# Altium project CW330_NewKintexFPGA.PrjPcb (part 3 of 5)

## Sheet CW340_SAM3X_MISC.SchDoc: MCU Misc Connections
size Letter; Organization: NewAE Technology Inc.; Address1: 1083 Queen St., Suite 196; Address2: Halifax; Address3: NS; Address4: Canada B3H 0B2; SheetApproved: NO
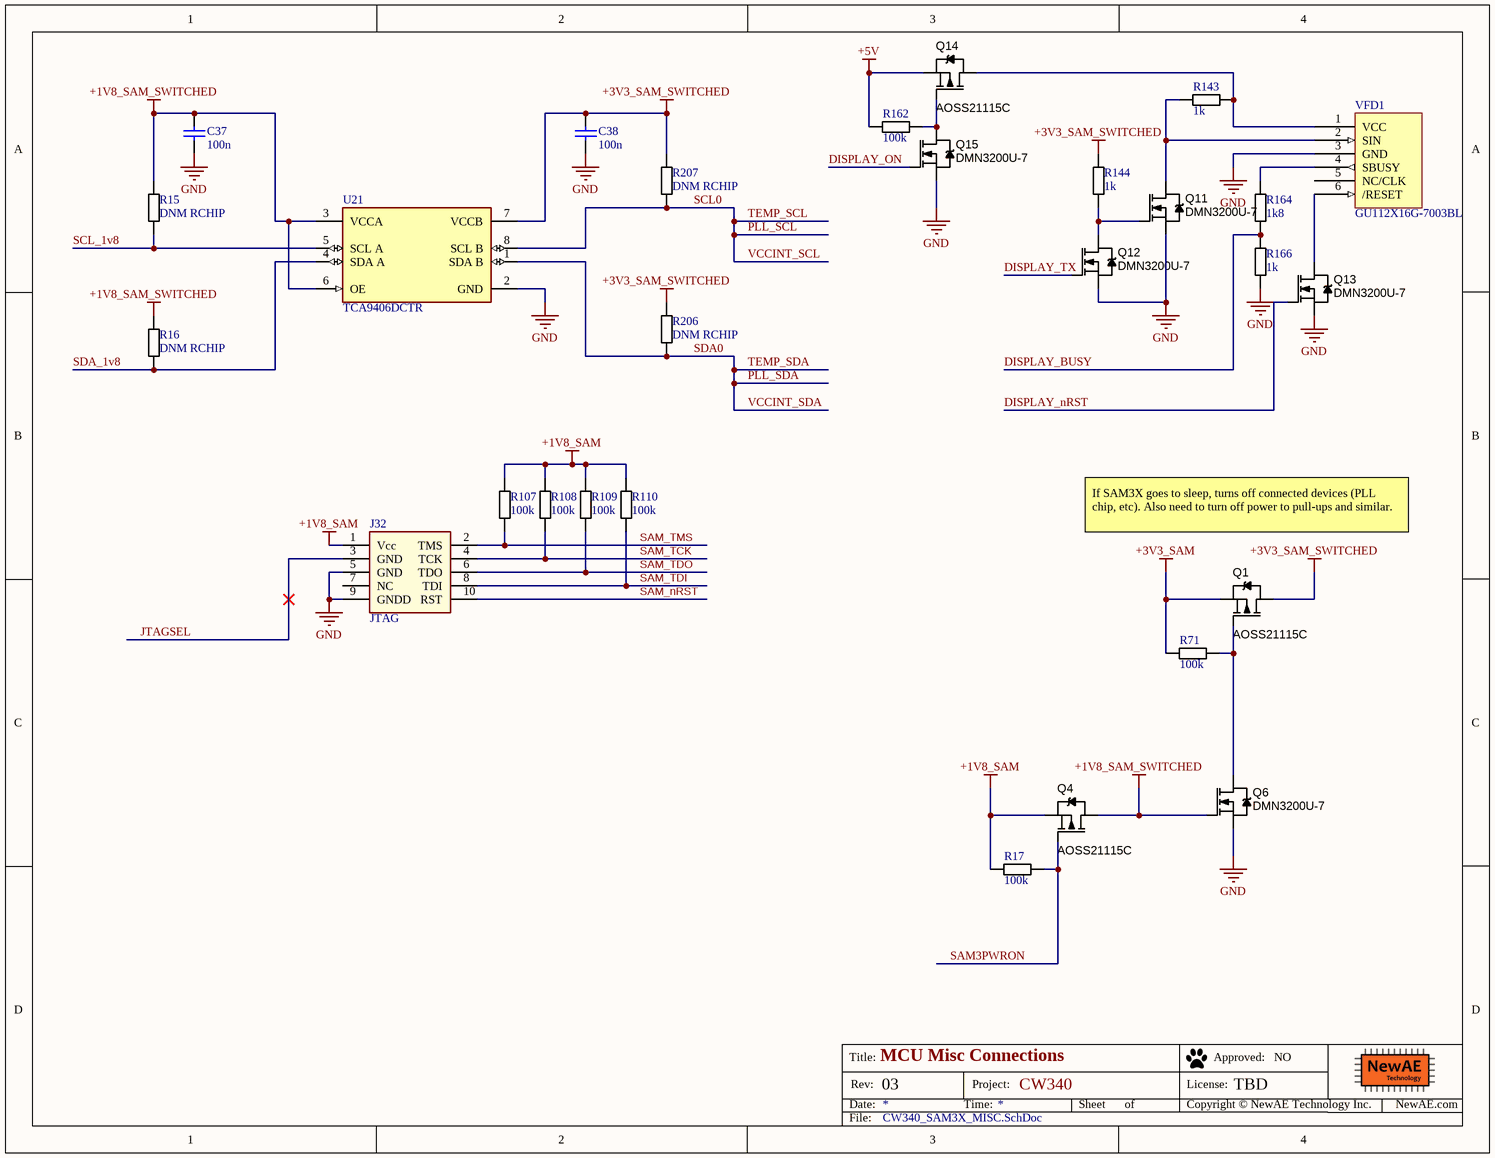
[diagram p13: CW340_SAM3X_MISC.SchDoc]

### Parts
C37  100n  [CAPC0402_M]
C38  100n  [CAPC0402_M]
J32  JTAG  [0.5mm_SMD_Header_5x2]
Q1  AOSS21115C  [SOT95P245X110-3M]
Q4  AOSS21115C  [SOT95P245X110-3M]
Q6  DMN3200U-7  [SOT95P245X110-3M]
Q11  DMN3200U-7  [SOT95P245X110-3M]
Q12  DMN3200U-7  [SOT95P245X110-3M]
Q13  DMN3200U-7  [SOT95P245X110-3M]
Q14  AOSS21115C  [SOT95P245X110-3M]
Q15  DMN3200U-7  [SOT95P245X110-3M]
R15  DNM RCHIP  [RESC1608X55N]
R16  DNM RCHIP  [RESC1608X55N]
R17  100k  [RESC1608X55N]
R71  100k  [RESC1608X55N]
R107  100k  [RESC1005X40N]
R108  100k  [RESC1005X40N]
R109  100k  [RESC1005X40N]
R110  100k  [RESC1005X40N]
R143  1k  [RESC1005X40N]
R144  1k  [RESC1005X40N]
R162  100k  [RESC1608X55N]
R164  1k8  [RESC1005X40N]
R166  1k  [RESC1005X40N]
R206  DNM RCHIP  [RESC1608X55N]
R207  DNM RCHIP  [RESC1608X55N]
U21  TCA9406DCTR  [FP-DCT0008A-MFG]
VFD1  GU112X16G-7003BL  [GU112X16G-7003BL]

### Nets
+1V8_SAM: J32.1(Vcc) Q4.2(S) R17.1 R107.1 R108.1 R109.1 R110.1  [project net +1V8_SAM_VDDBU]
+1V8_SAM_SWITCHED: C37.1 Q4.3(D) Q6.1(G) R15.1 R16.1 U21.3(VCCA) U21.6(OE)
+3V3_SAM: Q1.2(S) R71.1  [project net +3V3_SAM_VDDANA]
+3V3_SAM_SWITCHED: C38.1 Q1.3(D) R144.1 R206.1 R207.1 U21.7(VCCB)
+5V: Q14.2(S) R162.1
GND: C37.2 C38.2 J32.5(GND) J32.9(GNDD) Q6.2(S) Q11.2(S) Q12.2(S) Q13.2(S) Q15.2(S) R166.2 U21.2(GND) VFD1.3(GND)
DISPLAY_BUSY: R164.2 R166.1
DISPLAY_nRST: Q13.1(G)
DISPLAY_ON: Q15.1(G)
DISPLAY_TX: Q12.1(G)
JTAGSEL: J32.3(GND)
PLL_SCL: R207.2 U21.8(SCL_B)  [also labelled SCL0, TEMP_SCL, VCCINT_SCL]
PLL_SDA: R206.2 U21.1(SDA_B)  [also labelled SDA0, TEMP_SDA, VCCINT_SDA]
SAM3PWRON: Q4.1(G) R17.2
SAM_nRST: J32.10(RST)
SAM_TCK: J32.4(TCK) R108.2
SAM_TDI: J32.8(TDI) R110.2
SAM_TDO: J32.6(TDO) R109.2
SAM_TMS: J32.2(TMS) R107.2
SCL_1v8: R15.2 U21.5(SCL_A)
SDA_1v8: R16.2 U21.4(SDA_A)
NetQ1_1: Q1.1(G) Q6.3(D) R71.2
NetQ11_1: Q11.1(G) Q12.3(D) R144.2
NetQ11_3: Q11.3(D) R143.1 VFD1.2(SIN)
NetQ13_3: Q13.3(D) VFD1.6(/RESET)
NetQ14_1: Q14.1(G) Q15.3(D) R162.2
NetQ14_3: Q14.3(D) R143.2 VFD1.1(VCC)
NetR164_1: R164.1 VFD1.4(SBUSY)

Not connected (* = marked no-connect by the designer): J32 7(NC); VFD1 5(NC/CLK)

### Notes on the sheet
- If SAM3X goes to sleep, turns off connected devices (PLL chip, etc). Also need to turn off power to pull-ups and similar.
- Title:
- Date:
- Rev:
- Time:
- Project:
- Sheet
- of
- License:
- Copyright © NewAE Technology Inc.
- Approved:
- NewAE.com
- File:

### Library data of the parts
C37 C38 = CCHIP-100n-0402: 100n, 0402; Manufacture Part Number 1: CGA2B3X7R1V104K050BB; Component Group: Capacitor; Case-EIA: 0402; Part Number: CCHIP-100n-0402; Footprint: 0402; Pin Count: 2; Supplier 1: Digi-Key; Supplier Part Number 1: 445-6901-1-ND; Value: 100n; Mounting Technology: SMT; Component Kind: Standard; Component Type: Standard
J32 = Cortex_Debug_Header_10Pin: 10 Pin Cortex Program & Debug 0.5mm pitch; Manufacture 1: Samtec Inc; Manufacture Part Number 1: FTSH-105-01-L-DV-007-K; Component Group: Connector; PP Material Stack: 0; Part Number: Cortex_Debug_Header_10Pin; Pin Count: 10; Supplier 1: Digi-Key; Supplier Part Number 1: SAM9438-ND; Mounting Technology: SMT; RoHS: Yes; Component Kind: Standard; Component Type: Standard; PP Rotation: 0; Functionality: JTAG; 0_TEMP: 0.5mm_SMD_Header_5x2
Q1 Q4 Q14 = AOSS21115C: P-Channel, 4.5A, 1.8V Logic Level; Manufacture 1: Diodes Inc.; Component Group: MOSFET; Part Number: AOSS21115C; Footprint: SOT23; Manufacture Part Number 1: AOSS21115C; Pin Count: 3; Supplier 1: Digi-Key; Supplier Part Number 1: 785-AOSS21115CCT-ND; Mounting Technology: SMT; Component Kind: Standard; Component Type: Standard
Q6 Q11-Q13 Q15 = DMN3200U-7: MOSFET N-CH 30V 2.2A SOT23-3; Manufacture 1: Diodes Inc.; Rated Power: 3A; PP Material Stack: 0; Part Number: DMN3200U-7; Component Group: MOSFET; Footprint: SOT23; Manufacture Part Number 1: DMN3200U-7; Pin Count: 3; Supplier 1: Digi-Key; Supplier Part Number 1: DMN3200U-7DICT-ND; Rated Voltage: 30V; Mounting Technology: SMT; RoHS: Yes; Component Kind: Standard; Component Type: Standard; PP Rotation: 0
R15 R16 R206 R207 = RCHIP-DNM-0603: Do Not Mount Resistor; Case-EIA: 0603; Case-Metric: 1608; Part Number: RCHIP-DNM-0603; Component Group: Resistor; Footprint: 0603; Pin Count: 2; Mounting Technology: SMT; Component Kind: Standard; Component Type: Standard
R17 R71 R162 = RCHIP-100K-0603: 100k res, 0603, 1%, 1/10W; Manufacture 1: Yageo; Manufacture Part Number 1: RC0603FR-07100KL; Component Group: Resistor; Case-EIA: 0603; Case-Metric: 1608; Rated Power: 0.1W; Rated Voltage: 75VDC; Part Number: RCHIP-100K-0603; Footprint: 0603; Pin Count: 2; Supplier 1: Digi-Key; Supplier Part Number 1: 311-100KHRCT-ND; Value: 100k; Tolerance: 1%; Mounting Technology: SMT; Temperature Range: -55C to 155C; Component Kind: Standard; Component Type: Standard
R107-R110 = RCHIP-100K-0402: 100k res, 0402, 1%, 1/16W; Manufacture 1: Yageo; Manufacture Part Number 1: RC0402FR-07100KL; Component Group: Resistor; Case-EIA: 0402; Case-Metric: 1005; Rated Power: 0.063W; Rated Voltage: 75VDC; Part Number: RCHIP-100K-0402; Pin Count: 2; Supplier 1: Digi-Key; Supplier Part Number 1: 311-100KLRCT-ND; Value: 100k; Tolerance: 1%; Mounting Technology: SMT; Temperature Range: -55C to 155C; Component Kind: Standard; Component Type: Standard; Footprint: 0402
R143 R144 R166 = RCHIP-1K-0402: 1k res, 0402, 1%, 1/16W; Manufacture 1: Yageo; Manufacture Part Number 1: RC0402FR-071KL; Component Group: Resistor; Case-EIA: 0402; Case-Metric: 1005; Rated Power: 0.063W; Rated Voltage: 75VDC; Part Number: RCHIP-1K-0402; Footprint: 0402; Pin Count: 2; Supplier 1: Digi-Key; Supplier Part Number 1: 311-1.00KLRCT-ND; Value: 1k; Tolerance: 1%; Mounting Technology: SMT; Temperature Range: -55C to 155C; Component Kind: Standard; Component Type: Standard
R164 = RCHIP-1K8-0402: 1k8 res, 0402, 1%, 1/16W; Manufacture 1: Yageo; Manufacture Part Number 1: RC0402FR-071K8L; Component Group: Resistor; Case-EIA: 0402; Case-Metric: 1005; Rated Power: 0.063W; Rated Voltage: 75VDC; Part Number: RCHIP-1K8-0402; Footprint: 0402; Pin Count: 2; Supplier 1: Digi-Key; Supplier Part Number 1: 311-1.80KLRCT-ND; Value: 1k8; Tolerance: 1%; Mounting Technology: SMT; Temperature Range: -55C to 155C; Component Kind: Standard; Component Type: Standard
U21 = CMP-0314-00292-3: IC TRNSLTR BIDIRECTIONAL SM8; Output Type: Voltage; Low Level Output Current: 50mA; Turn-On Delay Time: 260ns; Number of Outputs: 2; Min Supply Voltage: 1.65V; High Level Output Current: -50mA; Data Rate: 24Mbps; Logic Function: Translator; Max Supply Voltage: 5.5V; Propagation Delay: 4.4ns; Packaging: Tape and Reel; Number of Channels: 2; Width: 2.9mm; REACH SVHC: No SVHC; Height: 1.2mm; Number of Bits: 2; Number of Pins: 8; Lead Free: Lead Free; RoHS Compliant: Yes; Case/Package: SSOP; Weight: 0.000705oz; Max Operating Temperature: 85°C; Contact Plating: Gold; Min Operating Temperature: -40°C; Radiation Hardening: No; Series: -; Length: 3.15mm; Package Quantity: 1
VFD1 = GU112X16G-7003BL: VFD Display; Component Group: PCB Feature; PP Material Stack: 0; Part Number: GU112X16G-7003BL; Pin Count: 6; Component Kind: Standard; Component Type: Standard; PP Rotation: 0; PP Rotation1: 0

## Sheet CW340_SAM3X_USB.SchDoc: MCU USB
size Letter; Organization: NewAE Technology Inc.; Address1: 1083 Queen St., Suite 196; Address2: Halifax; Address3: NS; Address4: Canada B3H 0B2; DocumentNumber: .; Revision: .; SheetNumber: 7; SheetTotal: 31; SheetApproved: NO
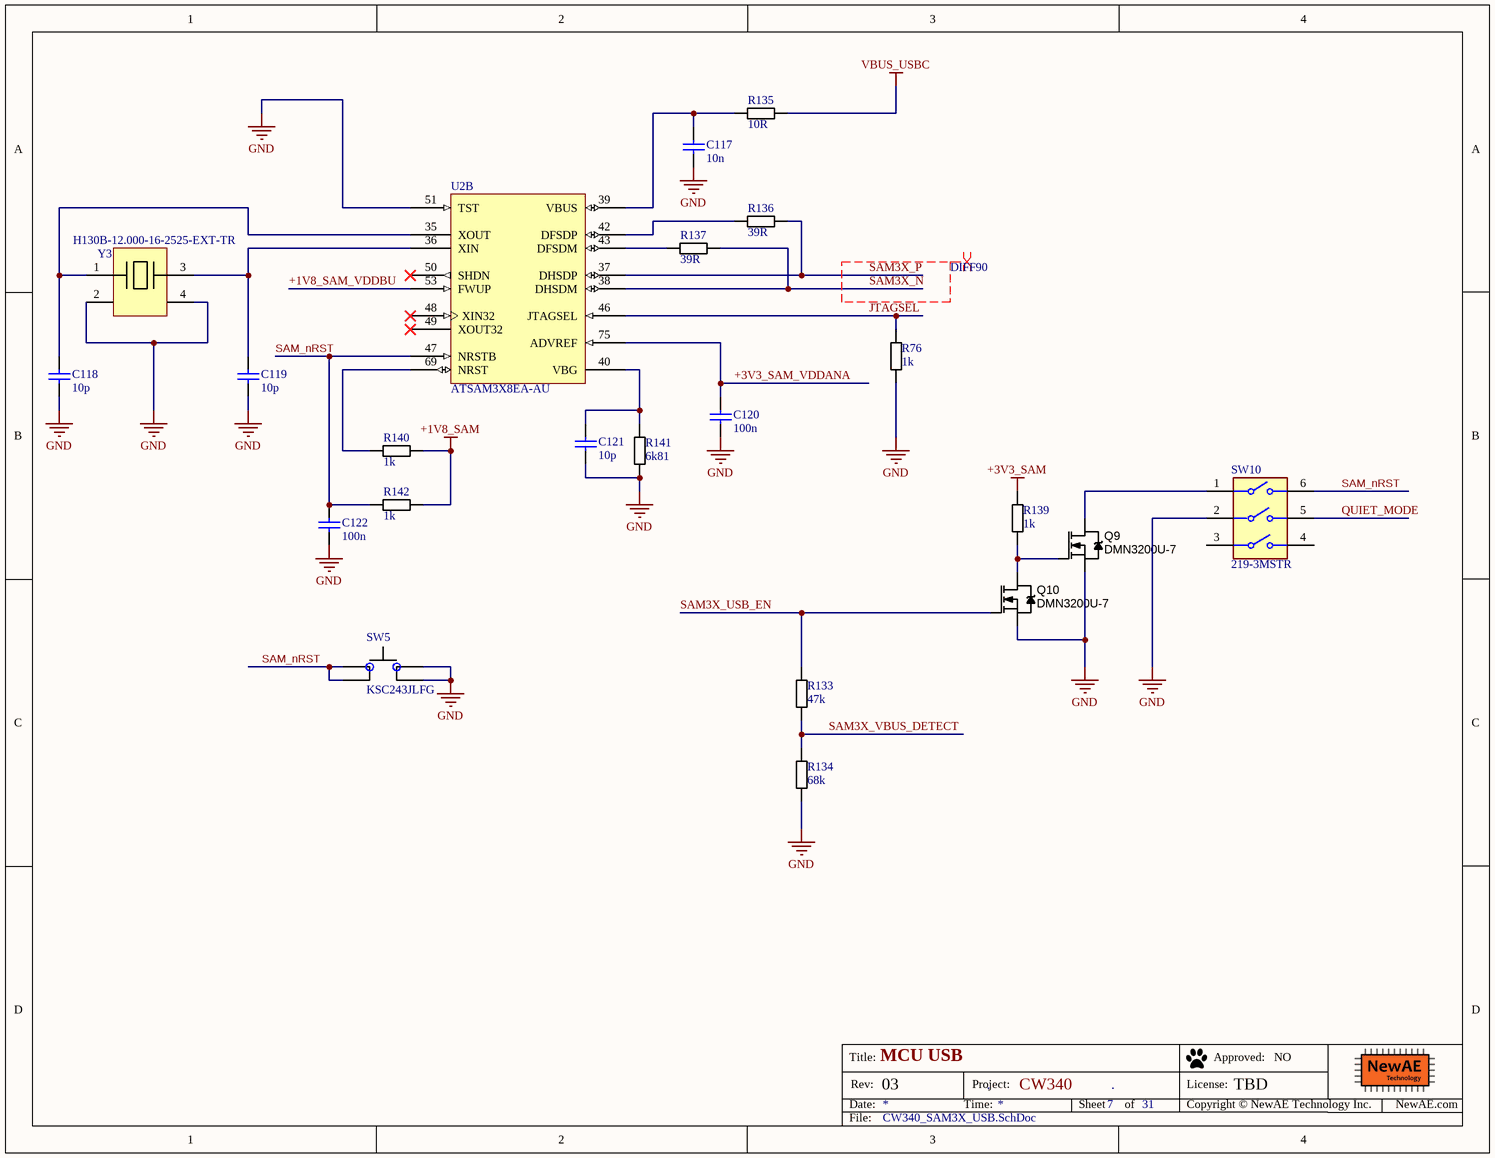
[diagram p14: CW340_SAM3X_USB.SchDoc]

### Parts
C117  10n  [CAPC0603_M]
C118  10p  [RESC1608X55N]
C119  10p  [RESC1608X55N]
C120  100n  [CAPC0402_M]
C121  10p  [CAPC0603_M]
C122  100n  [CAPC0402_M]
Q9  DMN3200U-7  [SOT95P245X110-3M]
Q10  DMN3200U-7  [SOT95P245X110-3M]
R76  1k  [RESC1005X40N]
R133  47k  [RESC1608X55N]
R134  68k  [RESC1608X55N]
R135  10R  [RESC1608X55N]
R136  39R  [RESC1608X55N]
R137  39R  [RESC1608X55N]
R139  1k  [RESC1005X40N]
R140  1k  [RESC1005X40N]
R141  6k81  [RESC1608X55N]
R142  1k  [RESC1005X40N]
SW5  KSC243JLFG  [CK_KSC2J]
SW10  219-3MSTR  [FP-219-3MSTR-MFG]
U2  ATSAM3X8EA-AU  [LQFP144_L]  (part B of 3)
Y3  H130B-12.000-16-2525-EXT-TR  [5x3.2MM XTAL]

### Nets
+1V8_SAM_VDDBU: R140.2 R142.1 U2.53(FWUP)  [also labelled +1V8_SAM]
+3V3_SAM_VDDANA: C120.1 R139.2 U2.75(ADVREF)  [also labelled +3V3_SAM]
GND: C117.2 C118.2 C119.2 C120.2 C121.2 C122.2 Q9.2(S) Q10.2(S) R76.2 R134.2 R141.2 SW5.2(IN) SW5.3(IN) SW10.2 U2.51(TST) Y3.2 Y3.4
VBUS_USBC: R135.2  [project net VUSB_USBC]
JTAGSEL: R76.1 U2.46(JTAGSEL)
QUIET_MODE: SW10.5
SAM3X_N: R137.2 U2.38(DHSDM)
SAM3X_P: R136.2 U2.37(DHSDP)
SAM3X_USB_EN: Q10.1(G) R133.1
SAM3X_VBUS_DETECT: R133.2 R134.1
SAM_nRST: C122.1 R142.2 SW5.1(IN) SW5.4(IN) SW10.6 U2.47(NRSTB)
NetC117_1: C117.1 R135.1 U2.39(VBUS)
NetC118_1: C118.1 U2.35(XOUT) Y3.1
NetC119_1: C119.1 U2.36(XIN) Y3.3
NetC121_1: C121.1 R141.1 U2.40(VBG)
NetQ9_1: Q9.1(G) Q10.3(D) R139.1
NetQ9_3: Q9.3(D) SW10.1
NetR136_1: R136.1 U2.42(DFSDP)
NetR137_1: R137.1 U2.43(DFSDM)
NetR140_1: R140.1 U2.69(NRST)

Not connected (* = marked no-connect by the designer): SW10 3 4; U2 48(XIN32)* 49(XOUT32)* 50(SHDN)*

### Layout directives
differential pair; differential pair class DIFF90: SAM3X_N, SAM3X_P

### Notes on the sheet
- Title:
- Date:
- Rev:
- Time:
- Project:
- Sheet
- of
- License:
- Copyright © NewAE Technology Inc.
- Approved:
- NewAE.com
- File:

### Library data of the parts
C117 = CCHIP-10n-0603: 10n, 0603; Component Group: Capacitor; Case-EIA: 0603; Case-Metric: 1608; Part Number: CCHIP-10n-0603; Footprint: 0603; Pin Count: 2; Supplier 1: Digi-Key; Supplier Part Number 1: 399-1091-1-ND; Value: 10n; Mounting Technology: SMT; Component Kind: Standard; Component Type: Standard
C118 C119 = CCHIP-10P-0603-50V: CAP CER 10PF 50V C0G/NP0 0603; Manufacture 1: Murata Electronics North America; Manufacture Part Number 1: GRM1885C1H100JA01D; Component Group: Capacitor; Case-EIA: 0603; Case-Metric: 1608; Tolerance: ±5%; PP Material Stack: 0; Part Number: CCHIP-10P-0603-50V; Footprint: 0603; Pin Count: 2; Supplier 1: Digi-Key; Supplier Part Number 1: 490-1403-1-ND; Value: 10p; Rated Voltage: 50V; Mounting Technology: SMT; Component Kind: Standard; Component Type: Standard; PP Rotation: 0
C120 C122 = CCHIP-100n-0402: as C37 on sheet CW340_SAM3X_MISC; Part Number: CCHIP-100n-0402; Footprint: 0402; Pin Count: 2; Value: 100n; Mounting Technology: SMT; Component Kind: Standard; Component Type: Standard; Supplier 1: Digi-Key; Supplier Part Number 1: 445-6901-1-ND
C121 = CCHIP-10p-0603: 10p, 0603; Component Group: Capacitor; Case-EIA: 0603; Case-Metric: 1608; Part Number: CCHIP-10p-0603; Footprint: 0603; Pin Count: 2; Supplier 1: Digi-Key; Supplier Part Number 1: 399-1049-1-ND; Value: 10p; Mounting Technology: SMT; Component Kind: Standard; Component Type: Standard
Q9 Q10 = DMN3200U-7: as Q6 on sheet CW340_SAM3X_MISC; Part Number: DMN3200U-7; Component Group: MOSFET; Footprint: SOT23; Manufacture Part Number 1: DMN3200U-7; Pin Count: 3; Supplier 1: Digi-Key; Supplier Part Number 1: DMN3200U-7DICT-ND; Rated Voltage: 30V; Mounting Technology: SMT; RoHS: Yes; Component Kind: Standard; Component Type: Standard; PP Rotation: 0
R76 R139 R140 R142 = RCHIP-1K-0402: as R143 on sheet CW340_SAM3X_MISC; Part Number: RCHIP-1K-0402; Footprint: 0402; Pin Count: 2; Supplier 1: Digi-Key; Supplier Part Number 1: 311-1.00KLRCT-ND; Value: 1k; Tolerance: 1%; Mounting Technology: SMT; Temperature Range: -55C to 155C; Component Kind: Standard; Component Type: Standard
R133 = RCHIP-47K-0603: 47k res, 0603, 1%, 1/10W; Manufacture 1: Yageo; Manufacture Part Number 1: RC0603FR-0747KL; Component Group: Resistor; Case-EIA: 0603; Case-Metric: 1608; Rated Power: 0.1W; Rated Voltage: 75VDC; Part Number: RCHIP-47K-0603; Footprint: 0603; Pin Count: 2; Supplier 1: Digi-Key; Supplier Part Number 1: 311-47.0KHRCT-ND; Value: 47k; Tolerance: 1%; Mounting Technology: SMT; Temperature Range: -55C to 155C; Component Kind: Standard; Component Type: Standard
R134 = RCHIP-68K-0603: 68k res, 0603, 1%, 1/10W; Manufacture 1: Yageo; Manufacture Part Number 1: RC0603FR-0768KL; Component Group: Resistor; Case-EIA: 0603; Case-Metric: 1608; Rated Power: 0.1W; Rated Voltage: 75VDC; Part Number: RCHIP-68K-0603; Footprint: 0603; Pin Count: 2; Supplier 1: Digi-Key; Supplier Part Number 1: 311-68.0KHRCT-ND; Value: 68k; Tolerance: 1%; Mounting Technology: SMT; Temperature Range: -55C to 155C; Component Kind: Standard; Component Type: Standard
R135 = RCHIP-10R-0603: 10R res, 0603, 1%, 1/10W; Manufacture 1: Yageo; Manufacture Part Number 1: RC0603FR-0710RL; Component Group: Resistor; Case-EIA: 0603; Case-Metric: 1608; Rated Power: 0.1W; Rated Voltage: 75VDC; Part Number: RCHIP-10R-0603; Footprint: 0603; Pin Count: 2; Supplier 1: Digi-Key; Supplier Part Number 1: 311-10.0HRCT-ND; Value: 10R; Tolerance: 1%; Mounting Technology: SMT; Temperature Range: -55C to 155C; Component Kind: Standard; Component Type: Standard
R136 R137 = RCHIP-39R-0603: 39R res, 0603, 1%, 1/10W; Manufacture 1: Yageo; Manufacture Part Number 1: RC0603FR-0739RL; Component Group: Resistor; Case-EIA: 0603; Case-Metric: 1608; Rated Power: 0.1W; Rated Voltage: 75VDC; Part Number: RCHIP-39R-0603; Footprint: 0603; Pin Count: 2; Supplier 1: Digi-Key; Supplier Part Number 1: 311-39.0HRCT-ND; Value: 39R; Tolerance: 1%; Mounting Technology: SMT; Temperature Range: -55C to 155C; Component Kind: Standard; Component Type: Standard
R141 = RCHIP-6K81-0603: 6k81 res, 0603, 1%, 1/10W; Manufacture 1: Yageo; Manufacture Part Number 1: RC0603FR-076K81L; Component Group: Resistor; Case-EIA: 0603; Case-Metric: 1608; Rated Power: 0.1W; Rated Voltage: 75VDC; Part Number: RCHIP-6K81-0603; Footprint: 0603; Pin Count: 2; Supplier 1: Digi-Key; Supplier Part Number 1: 311-6.81KHRCT-ND; Value: 6k81; Tolerance: 1%; Mounting Technology: SMT; Temperature Range: -55C to 155C; Component Kind: Standard; Component Type: Standard
SW5 = TACTSW-KSC243J: SWITCH TACTILE SPST-NO 0.01A 32V; Manufacture 1: C&K; Part Number: TACTSW-KSC243J; Component Group: Switch; Manufacture Part Number 1: KSC243JLFG; Pin Count: 4; Supplier 1: Digi-Key; Supplier Part Number 1: 401-1764-1-ND; Mounting Technology: SMT; RoHS: Yes; Component Kind: Standard; Component Type: Standard
SW10 = CMP-07018-000004-1: SWITCH SLIDE DIP SPST 100MA 20V; Washable: Yes; Mechanical Life: 2000Cycles; Number of Positions: 3; Pitch: 0.1inch; Actuator Type: Slide (Standard); Max Operating Temperature: 85°C; Voltage Rating (DC): 20V; Termination: Gull Wing; Length: 0.358inch; Min Operating Temperature: -55°C; Orientation: Straight; Mount: Surface Mount; Package Quantity: 1000; Current Rating: 100mA; Electrical Life: 2000Cycles; Max Current Rating: 100mA; Throw Configuration: SPST; Contact Material: Copper; Packaging: Tape and Reel; Contact Plating: Gold; Lead Free: Lead Free; Max Voltage Rating (DC): 20V
U2 = CMP-0076-00188-1: SAM3X ARM Cortex-M3 Flash-based Microcontroller, 512 KB Flash, 96 KB SRAM, 103 User I/Os, 1.62 to 3.6 V, -40 to 85 degC, 144-Pin LQFP, RoHS; Manufacturer: Atmel; UART: 5; Max. Operating Freq.: 84 MHz; ADC Resolution: 12 bits; Flash: 512 Kbytes; ADC Channels: 16; SRAM: 96 Kbytes; Max I/O Pins: 103; DAC Channels: 2; SPI: 4; # of Touch Channels: 32; Mounting Technology: Surface Mount; Operating Voltage: 1.62 to 3.6 V; ComponentLink2URL: http://www.atmel.com/Images/doc11057.pdf; CAN: 2; ComponentLink1Description: Manufacturer URL; RoHS: TRUE; PartNumber: ATSAM3X8EA-AU; Temp. Range: -40 to 85 degC; PackageVersion: 11057B; PackageDescription: 100-Pin Quad Flat Package, Body 20 x 20 mm, Pitch 0.5 mm; ComponentLink2Description: Datasheet; DatasheetVersion: 11057B; ComponentLink1URL: http://www.atmel.com/; ComponentLink3Description: Package Specification; ComponentLink3URL: http://www.atmel.com/Images/doc11057.pdf; PackageReference: LQFP-144
Y3 = H130B-12.000-16-2525-EXT-TR: 12MHz ±25ppm Crystal 16pF 35 Ohms 4-SMD, No Lead; Manufacture 1: Raltron Electronics; Value: 12.000MHz; PP Material Stack: 0; Supplier 1: Digi-Key; Stock 1: 4955; Pricing 1: 1=0.590000, 10=0.488000, 50=0.439400, 100=0.390600, 500=0.371100 (USD); Supplier Part Number 1: 2151-H130B-12.000-16-2525-EXT-TR-ND; .Checked SCH: *; .Checked PCB: *; Manufacturer Part Number: H130B-12.000-16-2525-EXT-TR; Part Number: H130B-12.000-16-2525-EXT-TR; Component Group: Crystal; Footprint: 5x3.2mm; Manufacture Part Number 1: H130B-12.000-16-2525-EXT-TR; Pin Count: 4; Mounting Technology: SMT; Component Kind: Standard; Component Type: Standard; PP Rotation: 0

## Sheet CW340_STATUS_LEDs.SchDoc: User LED / Switches
size Letter; Organization: NewAE Technology Inc.; Address1: 1083 Queen St., Suite 196; Address2: Halifax; Address3: NS; Address4: Canada B3H 0B2; DocumentNumber: .; Revision: .; SheetNumber: 30; SheetTotal: 31; SheetApproved: NO
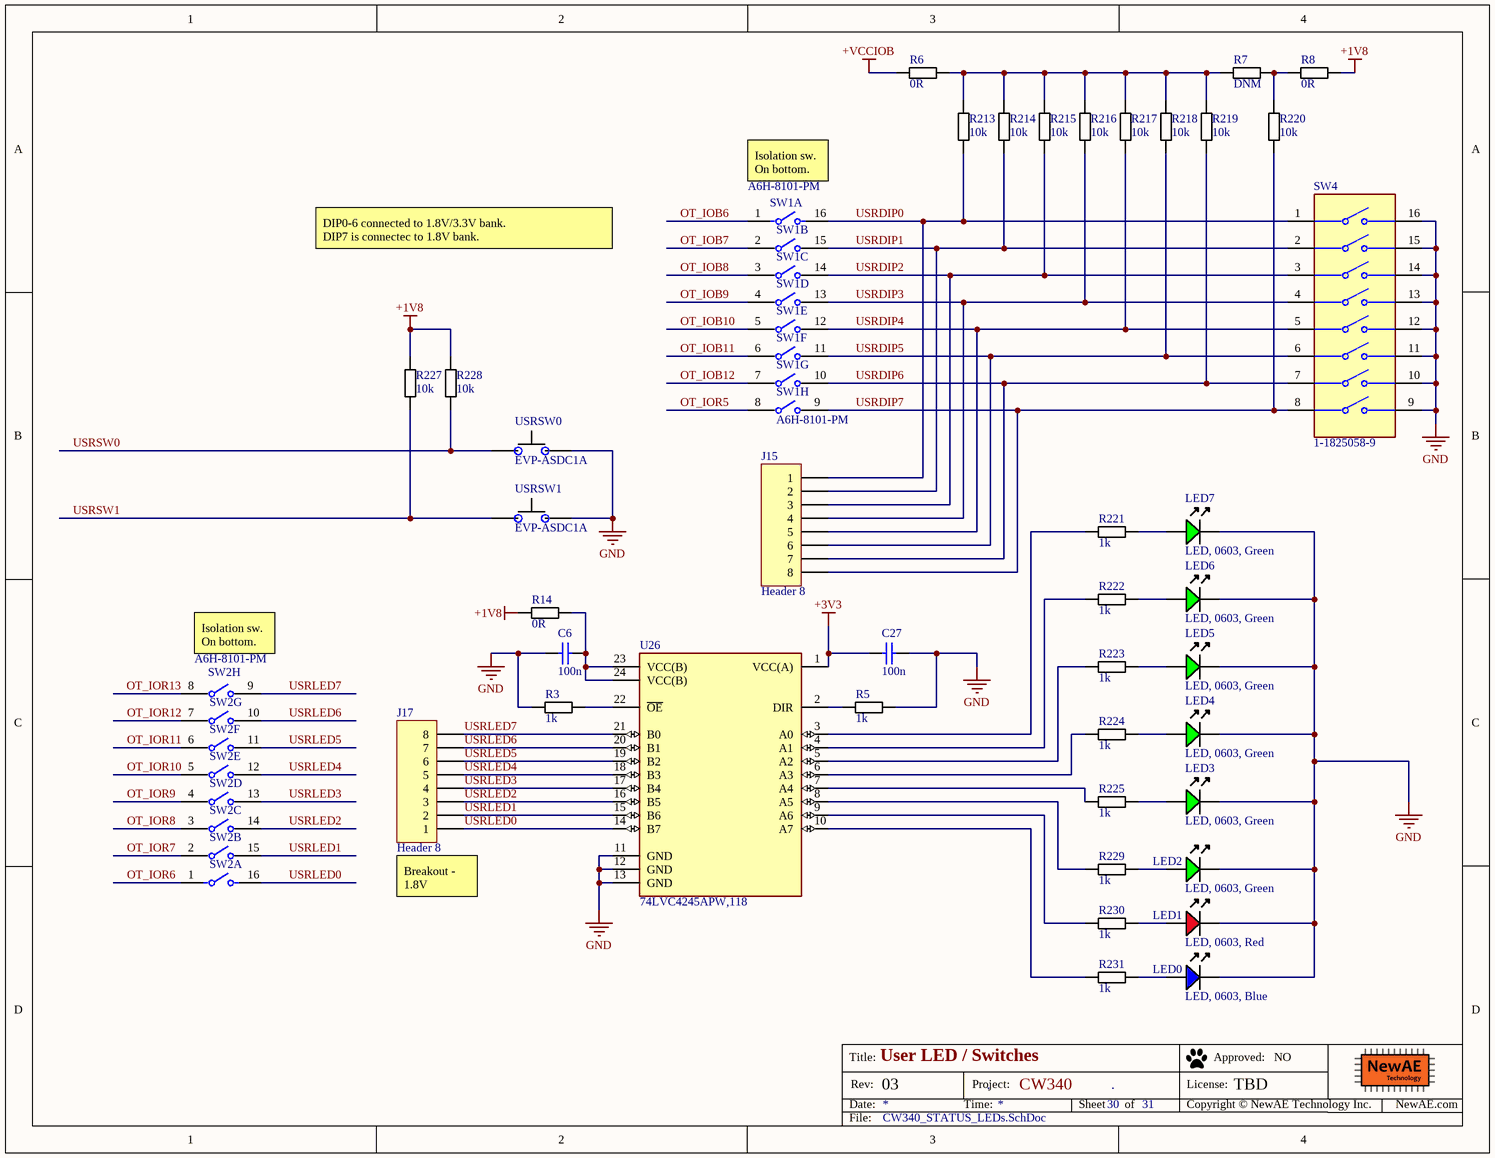
[diagram p15: CW340_STATUS_LEDs.SchDoc]

### Parts
C6  100n  [CAPC0402_M]
C27  100n  [CAPC0402_M]
J15  Header 8  [HDR1X8]
J17  Header 8  [HDR1X8]
LED0  LED, 0603, Blue  [LED-0603-BLUE]
LED1  LED, 0603, Red  [LED-0603-RED]
LED2  LED, 0603, Green  [LED-0603-GREEN]
LED3  LED, 0603, Green  [LED-0603-GREEN]
LED4  LED, 0603, Green  [LED-0603-GREEN]
LED5  LED, 0603, Green  [LED-0603-GREEN]
LED6  LED, 0603, Green  [LED-0603-GREEN]
LED7  LED, 0603, Green  [LED-0603-GREEN]
R3  1k  [RESC1005X40N]
R5  1k  [RESC1005X40N]
R6  0R  [RESC1005X40N]
R7  DNM  [RESC1005X40N]
R8  0R  [RESC1005X40N]
R14  0R  [RESC1005X40N]
R213  10k  [RESC1005X40N]
R214  10k  [RESC1005X40N]
R215  10k  [RESC1005X40N]
R216  10k  [RESC1005X40N]
R217  10k  [RESC1005X40N]
R218  10k  [RESC1005X40N]
R219  10k  [RESC1005X40N]
R220  10k  [RESC1005X40N]
R221  1k  [RESC1005X40N]
R222  1k  [RESC1005X40N]
R223  1k  [RESC1005X40N]
R224  1k  [RESC1005X40N]
R225  1k  [RESC1005X40N]
R227  10k  [RESC1005X40N]
R228  10k  [RESC1005X40N]
R229  1k  [RESC1005X40N]
R230  1k  [RESC1005X40N]
R231  1k  [RESC1005X40N]
SW1  A6H-8101-PM  [FP-A6H-8101-PM-MFG]  (parts A,B,C,D,E,F,G,H of 8)
SW2  A6H-8101-PM  [FP-A6H-8101-PM-MFG]  (value not drawn)  (parts A,B,C,D,E,F,G,H of 8)
SW4  1-1825058-9  [FP-1-1825058-9-MFG]
U26  74LVC4245APW,118  [FP-SOT355-1-MFG]
USRSW0  EVP-ASDC1A  [EVPAS]
USRSW1  EVP-ASDC1A  [EVPAS]

### Nets
+1V8: R8.2 R14.1 R227.1 R228.1
+3V3: C27.1 U26.1(VCC(A))
+VCCIOB: R6.1
GND: C6.1 C27.2 LED0.K LED1.K LED2.K LED3.K LED4.K LED5.K LED6.K LED7.K R3.1 R5.2 SW4.9 SW4.10 SW4.11 SW4.12 SW4.13 SW4.14 SW4.15 SW4.16 U26.11(GND) U26.12(GND) U26.13(GND) USRSW0.2(IN) USRSW1.2(IN)
OT_IOB6: SW1.1
OT_IOB7: SW1.2
OT_IOB8: SW1.3
OT_IOB9: SW1.4
OT_IOB10: SW1.5
OT_IOB11: SW1.6
OT_IOB12: SW1.7
OT_IOR5: SW1.8
OT_IOR6: SW2.1
OT_IOR7: SW2.2
OT_IOR8: SW2.3
OT_IOR9: SW2.4
OT_IOR10: SW2.5
OT_IOR11: SW2.6
OT_IOR12: SW2.7
OT_IOR13: SW2.8
USRDIP0: J15.1 R213.2 SW1.16 SW4.1
USRDIP1: J15.2 R214.2 SW1.15 SW4.2
USRDIP2: J15.3 R215.2 SW1.14 SW4.3
USRDIP3: J15.4 R216.2 SW1.13 SW4.4
USRDIP4: J15.5 R217.2 SW1.12 SW4.5
USRDIP5: J15.6 R218.2 SW1.11 SW4.6
USRDIP6: J15.7 R219.2 SW1.10 SW4.7
USRDIP7: J15.8 R220.2 SW1.9 SW4.8
USRLED0: J17.1 SW2.16 U26.14(B7)
USRLED1: J17.2 SW2.15 U26.15(B6)
USRLED2: J17.3 SW2.14 U26.16(B5)
USRLED3: J17.4 SW2.13 U26.17(B4)
USRLED4: J17.5 SW2.12 U26.18(B3)
USRLED5: J17.6 SW2.11 U26.19(B2)
USRLED6: J17.7 SW2.10 U26.20(B1)
USRLED7: J17.8 SW2.9 U26.21(B0)
USRSW0: R228.2 USRSW0.1(IN)
USRSW1: R227.2 USRSW1.1(IN)
NetC6_2: C6.2 R14.2 U26.23(VCC(B)) U26.24(VCC(B))
NetLED0_A: LED0.A R231.2
NetLED1_A: LED1.A R230.2
NetLED2_A: LED2.A R229.2
NetLED3_A: LED3.A R225.2
NetLED4_A: LED4.A R224.2
NetLED5_A: LED5.A R223.2
NetLED6_A: LED6.A R222.2
NetLED7_A: LED7.A R221.2
NetR3_2: R3.2 U26.22(~{OE})
NetR5_1: R5.1 U26.2(DIR)
NetR6_2: R6.2 R7.1 R213.1 R214.1 R215.1 R216.1 R217.1 R218.1 R219.1
NetR7_2: R7.2 R8.1 R220.1
NetR221_1: R221.1 U26.3(A0)
NetR222_1: R222.1 U26.4(A1)
NetR223_1: R223.1 U26.5(A2)
NetR224_1: R224.1 U26.6(A3)
NetR225_1: R225.1 U26.7(A4)
NetR229_1: R229.1 U26.8(A5)
NetR230_1: R230.1 U26.9(A6)
NetR231_1: R231.1 U26.10(A7)

### Notes on the sheet
- (near SW1) Isolation sw. On bottom.
- DIP0-6 connected to 1.8V/3.3V bank.
  DIP7 is connectec to 1.8V bank.
- (near SW2) Isolation sw. On bottom.
- (near J17) Breakout - 1.8V
- Title:
- Date:
- Rev:
- Time:
- Project:
- Sheet
- of
- License:
- Copyright © NewAE Technology Inc.
- Approved:
- NewAE.com
- File:

### Library data of the parts
C6 C27 = CCHIP-100n-0402: as C37 on sheet CW340_SAM3X_MISC; Part Number: CCHIP-100n-0402; Footprint: 0402; Pin Count: 2; Supplier 1: Digi-Key; Supplier Part Number 1: 445-6901-1-ND; Value: 100n; Mounting Technology: SMT; Component Kind: Standard; Component Type: Standard
J15 J17 = Header 8: Header, 8-Pin; LatestRevisionDate: 17-Jul-2002; LatestRevisionNote: Re-released for DXP Platform.; Publisher: Altium Limited
LED0 = LEDCHIP_0603_BLUE: Chip LED, Blue; Manufacture 1: Kingbright; Manufacture Part Number 1: APT1608QBC/D; Component Group: Optical; Part Number: LEDCHIP_0603_BLUE; Pin Count: 2; Mounting Technology: SMT; Component Kind: Standard; Component Type: Standard
LED1 = LEDCHIP_0603_RED: Chip LED, Red; Manufacture 1: Kingbright; Manufacture Part Number 1: APT1608SRCPRV; Component Group: Optical; PP Material Stack: 15; PP Rotation: -90; Part Number: LEDCHIP_0603_RED; Pin Count: 2; Supplier 1: Digi-Key; Supplier Part Number 1: 754-1122-1-ND; Mounting Technology: SMT; Component Kind: Standard; Component Type: Standard
LED2-LED7 = LEDCHIP_0603_GREEN: Chip LED, Green; Manufacture 1: Kingbright; Manufacture Part Number 1: APT1608CGCK; Component Group: Optical; PP Material Stack: 16; PP Rotation: -90; Part Number: LEDCHIP_0603_GREEN; Pin Count: 2; Supplier 1: Digi-Key; Supplier Part Number 1: 754-1116-1-ND; Mounting Technology: SMT; Component Kind: Standard; Component Type: Standard
R3 R5 R221-R225 R229-R231 = RCHIP-1K-0402: as R143 on sheet CW340_SAM3X_MISC; Part Number: RCHIP-1K-0402; Footprint: 0402; Pin Count: 2; Supplier 1: Digi-Key; Supplier Part Number 1: 311-1.00KLRCT-ND; Value: 1k; Tolerance: 1%; Mounting Technology: SMT; Temperature Range: -55C to 155C; Component Kind: Standard; Component Type: Standard
R6 R8 R14 = RCHIP-0R-0402: Manufacture 1: Yageo; Manufacture Part Number 1: RC0402FR-070RL; Component Group: Resistor; Case-EIA: 0402; Case-Metric: 1005; Part Number: RCHIP-0R-0402; Footprint: 0402; Pin Count: 2; Supplier 1: Digi-Key; Supplier Part Number 1: 311-0.0LRCT-ND; Value: 0R; Component Kind: Standard; Component Type: Standard
R7 = RCHIP-DNM-0402: Component Group: Resistor; Case-EIA: 0402; Case-Metric: 1005; Part Number: RCHIP-DNM-0402; Footprint: 0402; Pin Count: 2; Value: DNM; Component Kind: Standard; Component Type: Standard
R213-R220 R227 R228 = RCHIP-10K-0402: 10k res, 0402, 1%, 1/16W; Manufacture 1: Yageo; Manufacture Part Number 1: RC0402FR-0710KL; Component Group: Resistor; Case-EIA: 0402; Case-Metric: 1005; Rated Power: 0.063W; Rated Voltage: 75VDC; Part Number: RCHIP-10K-0402; Footprint: 0402; Pin Count: 2; Supplier 1: Digi-Key; Supplier Part Number 1: 311-10.0KLRCT-ND; Value: 10k; Tolerance: 1%; Mounting Technology: SMT; Temperature Range: -55C to 155C; Component Kind: Standard; Component Type: Standard
SW1 SW2 = CMP-08827-000045-1: SWITCH SLIDE DIP SPST 25MA 24V; Number of Positions: 8; Actuator Type: Slide (Standard); Mechanical Life: 1000Cycles; Pitch: 0.05inch; Washable: No; Radiation Hardening: No; Max Operating Temperature: 70°C; Packaging: Tape and Reel; Max Current Rating: 25mA; Mount: Surface Mount; Voltage Rating (DC): 24V; Package Quantity: 4000; Length: 0.448inch; Depth: 6.7mm; Orientation: Straight; Throw Configuration: SPST; Termination: Gull Wing; Max Voltage Rating (DC): 24V; Series: A6H; Min Operating Temperature: -20°C; Current Rating: 25mA; Electrical Life: 1000Cycles
SW4 = CMP-03400-000015-1: SWITCH SLIDE DIP SPST 100MA 24V; Manufacturer: TE Connectivity; Current Rating: 1A; Electromechanical Life: 1000Cycles; Contact Resistance: 50mΩ; Number Of Circuits: 8; Device Class L1: Electromechanical; Manufacturer Part Number: 1-1825058-9; Height: 5.1mm; ComponentLink2Description: Datasheet; Temperature Range High: +85°C; Digikey Description: SWITCH SLIDE DIP SPST 100MA 24V; Voltage Rating Dc: 24V; Package: 0; Automotive: No; ComponentLink2URL: https://www.te.com/commerce/DocumentDelivery/DDEController?Action=showdoc&DocId=Customer+Drawing%7F1825058%7FS5%7Fpdf%7FEnglish%7FENG_CD_1825058_S5.pdf%7F1-1825058-9; Octopart: https://octopart.com/1-1825058-9-te+connectivity-46507285; Temperature Range Low: -30°C; Device Class L2: Switches; Contact Current Rating: 100mA; Mount: Surface Mount; Temperature: -30°C to +85°C; Category: Switch; Device Class L3: DIP Switches; Lead Free: Yes; Throw Configuration: SPST; RoHS: TRUE
U26 = CMP-14346-000006-1: IC TRNSLTR BIDIRECTIONAL 24TSSOP; RoHS Compliant: Yes
USRSW0 USRSW1 = EVP-ASDC1A: Pushbutton, SMD, 2.5NM force, NO; Manufacture 1: Panasonic; Component Group: Switch; Part Number: EVP-ASDC1A; Manufacture Part Number 1: EVP-ASDC1A; Pin Count: 2; Supplier 1: Digi-Key; Supplier Part Number 1: P16856CT-ND; Mounting Technology: SMT; Component Kind: Standard; Component Type: Standard

## Sheet CW340_USERIO_debug.SchDoc: User Debug Headers
size Letter; Organization: NewAE Technology Inc.; Address1: 1083 Queen St., Suite 196; Address2: Halifax; Address3: NS; Address4: Canada B3H 0B2; DocumentNumber: .; Revision: .; SheetNumber: 25; SheetTotal: 31; SheetApproved: Yes
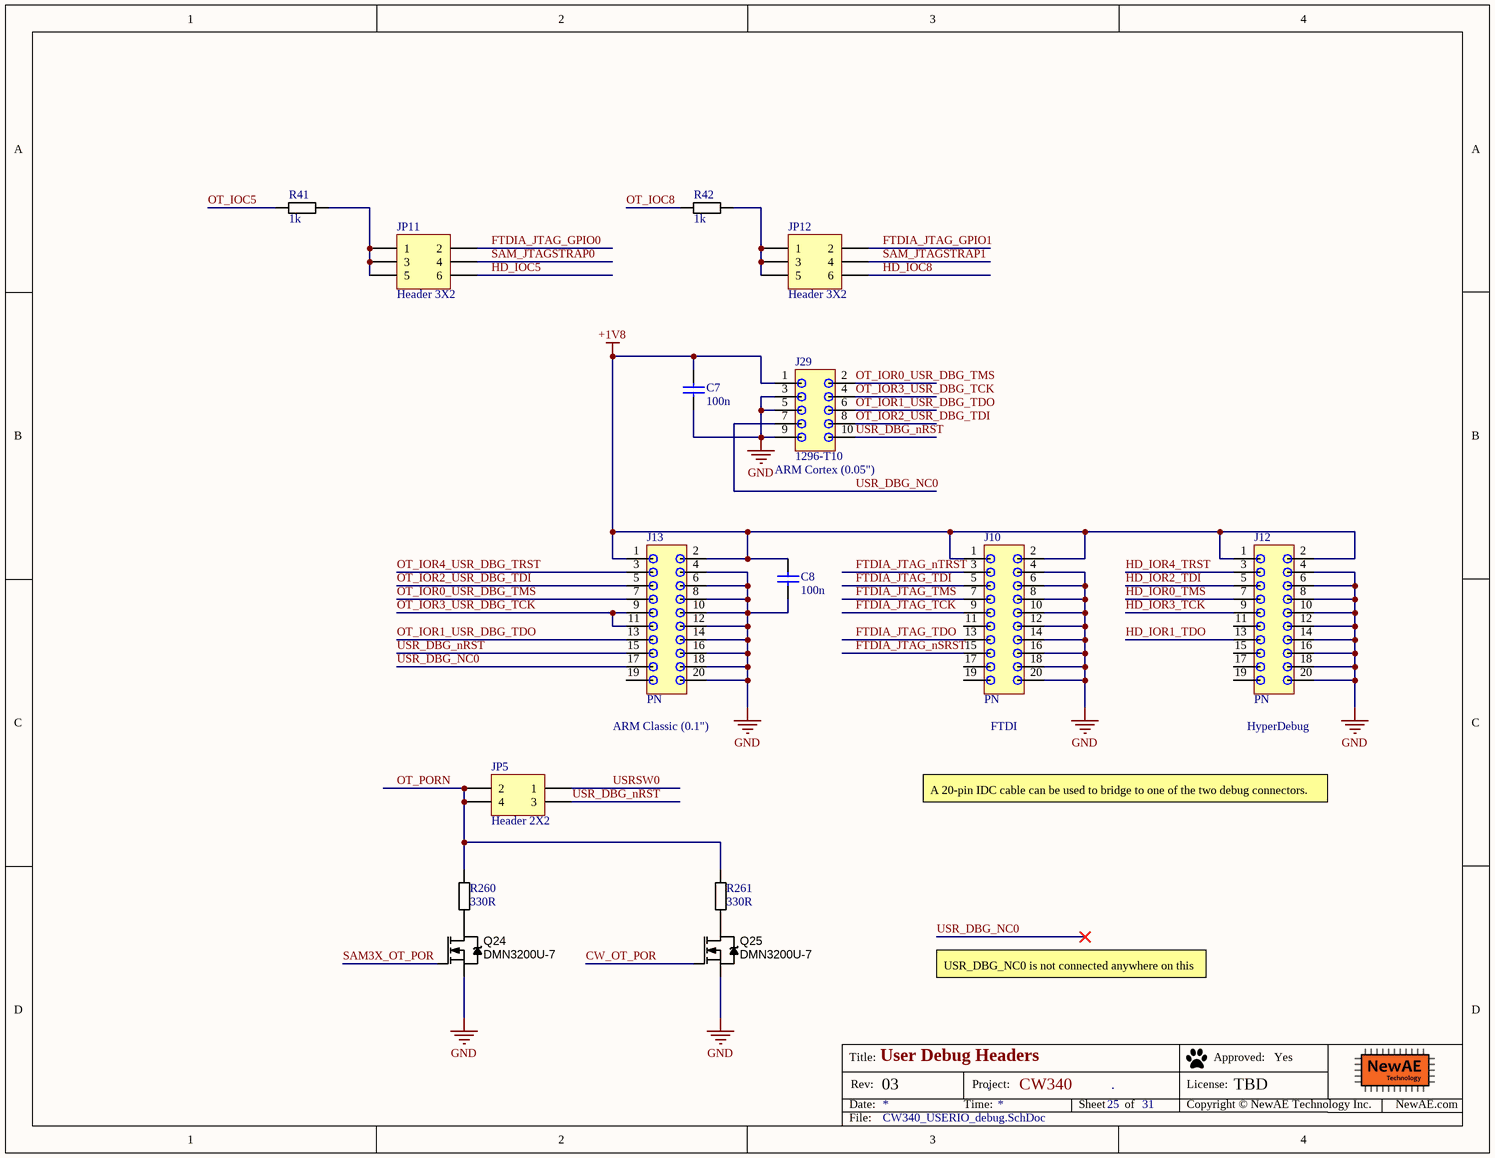
[diagram p16: CW340_USERIO_debug.SchDoc]

### Parts
C7  100n  [CAPC0603_M]
C8  100n  [CAPC0603_M]
J10  PN  [CONN_10x2_SHROUDED_2.54mm]
J12  PN  [CONN_10x2_SHROUDED_2.54mm]
J13  PN  [CONN_10x2_SHROUDED_2.54mm]
J29  1296-T10  [1296-T10]
JP5  Header 2X2  [HDR2X2]
JP11  Header 3X2  [HDR2X3]
JP12  Header 3X2  [HDR2X3]
Q24  DMN3200U-7  [SOT95P245X110-3M]
Q25  DMN3200U-7  [SOT95P245X110-3M]
R41  1k  [RESC1608X55N]
R42  1k  [RESC1608X55N]
R260  330R  [RESC1608X55N]
R261  330R  [RESC1608X55N]

### Nets
+1V8: C7.2 C8.2 J10.1 J10.2 J12.1 J12.2 J13.1 J13.2 J29.1
GND: C7.1 C8.1 J10.4 J10.6 J10.8 J10.10 J10.12 J10.14 J10.16 J10.18 J10.20 J12.4 J12.6 J12.8 J12.10 J12.12 J12.14 J12.16 J12.18 J12.20 J13.4 J13.6 J13.8 J13.10 J13.12 J13.14 J13.16 J13.18 J13.20 J29.3 J29.5 J29.9 Q24.2(S) Q25.2(S)
CW_OT_POR: Q25.1(G)
FTDIA_JTAG_GPIO0: JP11.2
FTDIA_JTAG_GPIO1: JP12.2
FTDIA_JTAG_nSRST: J10.15
FTDIA_JTAG_nTRST: J10.3
FTDIA_JTAG_TCK: J10.9
FTDIA_JTAG_TDI: J10.5
FTDIA_JTAG_TDO: J10.13
FTDIA_JTAG_TMS: J10.7
HD_IOC5: JP11.6
HD_IOC8: JP12.6
HD_IOR0_TMS: J12.7
HD_IOR1_TDO: J12.13
HD_IOR2_TDI: J12.5
HD_IOR3_TCK: J12.9
HD_IOR4_TRST: J12.3
OT_IOC5: R41.1
OT_IOC8: R42.1
OT_IOR0_USR_DBG_TMS: J13.7 J29.2
OT_IOR1_USR_DBG_TDO: J13.13 J29.6
OT_IOR2_USR_DBG_TDI: J13.5 J29.8
OT_IOR3_USR_DBG_TCK: J13.9 J13.11 J29.4
OT_IOR4_USR_DBG_TRST: J13.3
OT_PORN: JP5.2 JP5.4 R260.2 R261.2
SAM3X_OT_POR: Q24.1(G)
SAM_JTAGSTRAP0: JP11.4
SAM_JTAGSTRAP1: JP12.4
USR_DBG_NC0: J13.17 J29.7
USR_DBG_nRST: J13.15 J29.10 JP5.3
USRSW0: JP5.1
NetJP11_1: JP11.1 JP11.3 JP11.5 R41.2
NetJP12_1: JP12.1 JP12.3 JP12.5 R42.2
NetQ24_3: Q24.3(D) R260.1
NetQ25_3: Q25.3(D) R261.1

Not connected (* = marked no-connect by the designer): J10 11(9) 17(9) 19(9); J12 11(9) 15(9) 17(9) 19(9); J13 19(9)

### Notes on the sheet
- (near J29) ARM Cortex (0.05")
- (near J13) ARM Classic (0.1")
- (near J10) FTDI
- (near J12) HyperDebug
- A 20-pin IDC cable can be used to bridge to one of the two debug connectors.
- USR_DBG_NC0 is not connected anywhere on this rev/board.
- Title:
- Date:
- Rev:
- Time:
- Project:
- Sheet
- of
- License:
- Copyright © NewAE Technology Inc.
- Approved:
- NewAE.com
- File:

### Library data of the parts
C7 C8 = CCHIP-100n-0603: 100n, 0603; Manufacture 1: Kemet; Manufacture Part Number 1: C0603C104K5RACTU; Component Group: Capacitor; Case-EIA: 0603; Case-Metric: 1608; Rated Voltage: 50VDC; Part Number: CCHIP-100n-0603; Footprint: 0603; Pin Count: 2; Supplier 1: Digi-Key; Supplier Part Number 1: 399-5089-2-ND; Value: 100n; Mounting Technology: SMT; Component Kind: Standard; Component Type: Standard
J10 J12 J13 = CONN20_2ROW: Header, 2-Row, 20-pin, 0.1"; Component Group: Connector; Part Number: CONN20_2ROW; Pin Count: 20; Mounting Technology: SMT; Component Kind: Standard; Component Type: Standard
J29 = 1296-T10: Header, 10-pin, SMD, 0.05"; Manufacture Part Number 1: 20021121-00010C4LF; Component Group: Connector; Part Number: 1296-T10; Pin Count: 10; Supplier 1: Digi-Key; Supplier Part Number 1: 609-3695-1-ND; Mounting Technology: SMT; Component Kind: Standard; Component Type: Standard
JP5 = Header 2X2: Header, 2-Pin, Dual row; LatestRevisionDate: 17-Jul-2002; LatestRevisionNote: Re-released for DXP Platform.; Publisher: Altium Limited
JP11 JP12 = Header 3X2: Header, 3-Pin, Dual row; LatestRevisionDate: 17-Jul-2002; LatestRevisionNote: Re-released for DXP Platform.; Publisher: Altium Limited
Q24 Q25 = DMN3200U-7: as Q6 on sheet CW340_SAM3X_MISC; Part Number: DMN3200U-7; Component Group: MOSFET; Footprint: SOT23; Manufacture Part Number 1: DMN3200U-7; Pin Count: 3; Supplier 1: Digi-Key; Supplier Part Number 1: DMN3200U-7DICT-ND; Rated Voltage: 30V; Mounting Technology: SMT; RoHS: Yes; Component Kind: Standard; Component Type: Standard; PP Rotation: 0
R41 R42 = RCHIP-1K-0603: 1k res, 0603, 1%, 1/10W; Manufacture 1: Yageo; Manufacture Part Number 1: RC0603FR-071KL; Component Group: Resistor; Case-EIA: 0603; Case-Metric: 1608; Rated Power: 0.1W; Rated Voltage: 75VDC; Part Number: RCHIP-1K-0603; Footprint: 0603; Pin Count: 2; Supplier 1: Digi-Key; Supplier Part Number 1: 311-1.00KHRCT-ND; Value: 1k; Tolerance: 1%; Mounting Technology: SMT; Temperature Range: -55C to 155C; Component Kind: Standard; Component Type: Standard
R260 R261 = RCHIP-330R-0603: 330R res, 0603, 1%, 1/10W; Manufacture 1: Yageo; Manufacture Part Number 1: RC0603FR-07330RL; Component Group: Resistor; Case-EIA: 0603; Case-Metric: 1608; Rated Power: 0.1W; Rated Voltage: 75VDC; Part Number: RCHIP-330R-0603; Footprint: 0603; Pin Count: 2; Supplier 1: Digi-Key; Supplier Part Number 1: 311-330HRCT-ND; Value: 330R; Tolerance: 1%; Mounting Technology: SMT; Temperature Range: -55C to 155C; Component Kind: Standard; Component Type: Standard

## Sheet CW340_USERIO_Header.SchDoc: User GPIO Headers
size Letter; Organization: NewAE Technology Inc.; Address1: 1083 Queen St., Suite 196; Address2: Halifax; Address3: NS; Address4: Canada B3H 0B2; DocumentNumber: .; Revision: .; SheetNumber: 26; SheetTotal: 31; SheetApproved: Yes
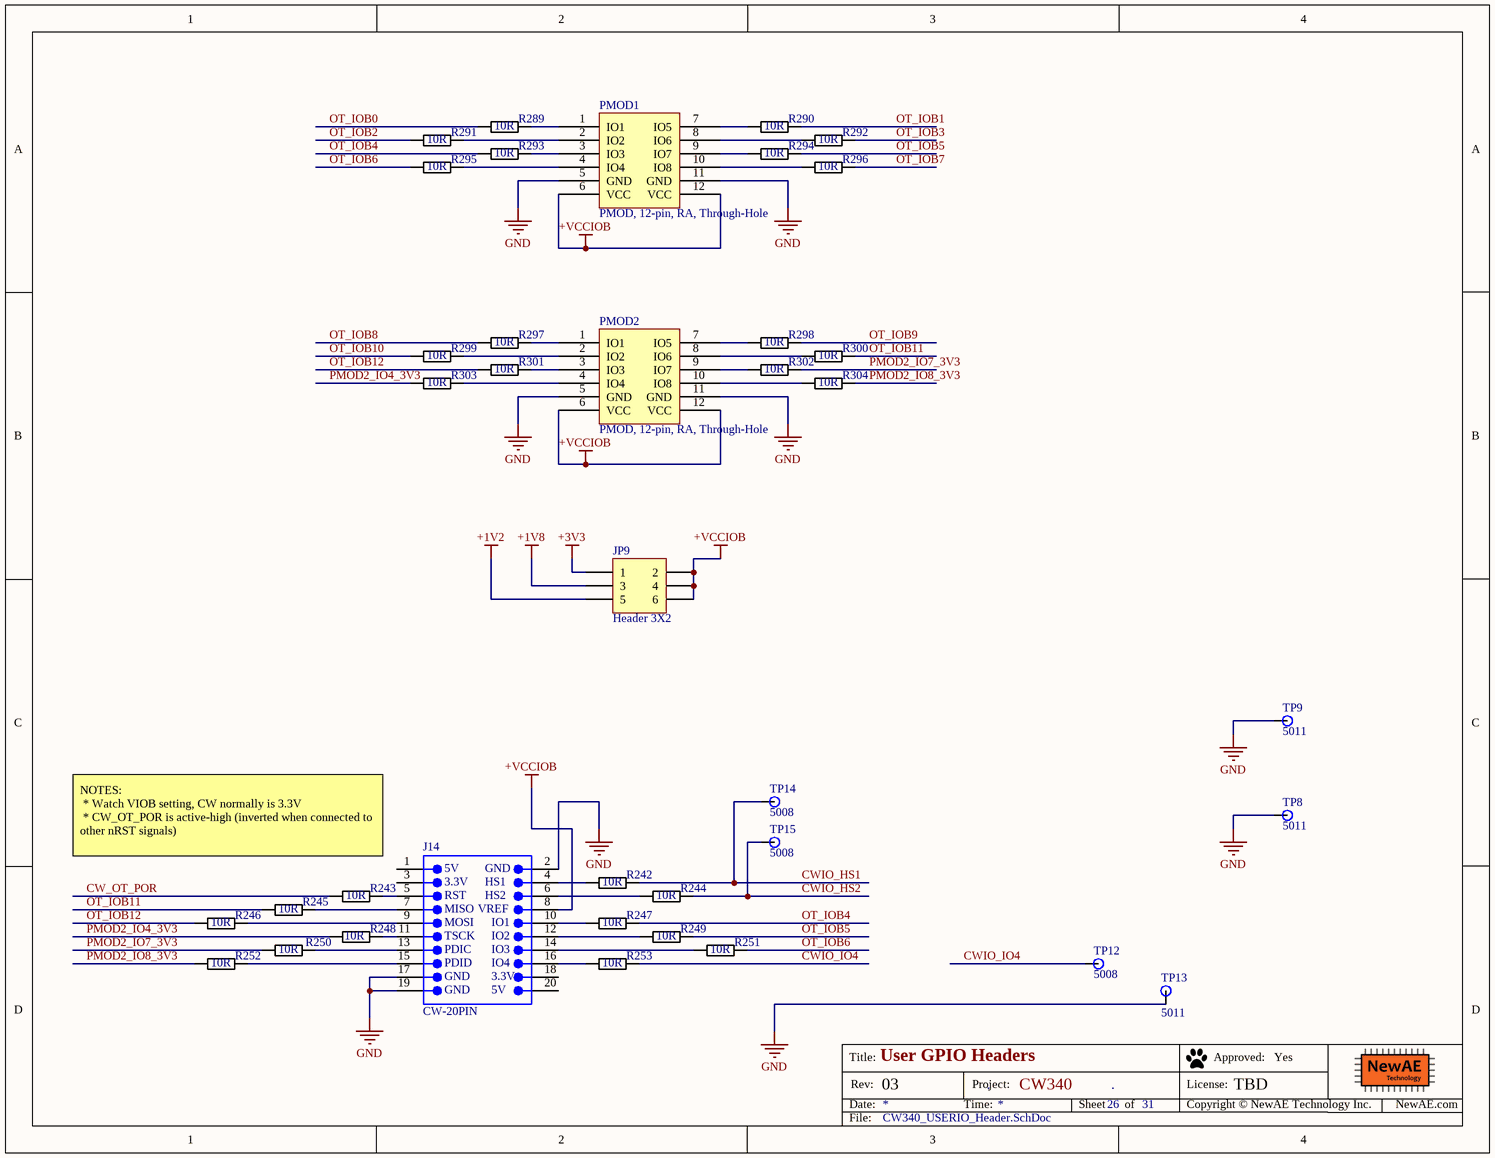
[diagram p17: CW340_USERIO_Header.SchDoc]

### Parts
J14  CW-20PIN  [CONN_10x2_SHROUDED_2.54mm]
JP9  Header 3X2  [HDR2X3]
PMOD1  PMOD, 12-pin, RA, Through-Hole  [SAMTEC_SSW_106_02_X_D_RA_PMOD]
PMOD2  PMOD, 12-pin, RA, Through-Hole  [SAMTEC_SSW_106_02_X_D_RA_PMOD]
R242  10R  [RESC1005X40N]
R243  10R  [RESC1005X40N]
R244  10R  [RESC1005X40N]
R245  10R  [RESC1005X40N]
R246  10R  [RESC1005X40N]
R247  10R  [RESC1005X40N]
R248  10R  [RESC1005X40N]
R249  10R  [RESC1005X40N]
R250  10R  [RESC1005X40N]
R251  10R  [RESC1005X40N]
R252  10R  [RESC1005X40N]
R253  10R  [RESC1005X40N]
R289  10R  [RESC1005X40N]
R290  10R  [RESC1005X40N]
R291  10R  [RESC1005X40N]
R292  10R  [RESC1005X40N]
R293  10R  [RESC1005X40N]
R294  10R  [RESC1005X40N]
R295  10R  [RESC1005X40N]
R296  10R  [RESC1005X40N]
R297  10R  [RESC1005X40N]
R298  10R  [RESC1005X40N]
R299  10R  [RESC1005X40N]
R300  10R  [RESC1005X40N]
R301  10R  [RESC1005X40N]
R302  10R  [RESC1005X40N]
R303  10R  [RESC1005X40N]
R304  10R  [RESC1005X40N]
TP8  5011  [KEYSTONE5011]
TP9  5011  [KEYSTONE5011]
TP12  5008  [KEYSTONE5008]
TP13  5011  [KEYSTONE5011]
TP14  5008  [KEYSTONE5008]
TP15  5008  [KEYSTONE5008]

### Nets
+1V2: JP9.5
+1V8: JP9.3
+3V3: JP9.1
+VCCIOB: J14.8 JP9.2 JP9.4 JP9.6 PMOD1.6(VCC) PMOD1.12(VCC) PMOD2.6(VCC) PMOD2.12(VCC)
GND: J14.2 J14.17 J14.19 PMOD1.5(GND) PMOD1.11(GND) PMOD2.5(GND) PMOD2.11(GND) TP8.1 TP9.1 TP13.1
CW_OT_POR: R243.1
CWIO_HS1: R242.2 TP14.1
CWIO_HS2: R244.2 TP15.1
CWIO_IO4: R253.2 TP12.1
OT_IOB0: R289.1
OT_IOB1: R290.2
OT_IOB2: R291.1
OT_IOB3: R292.2
OT_IOB4: R247.2 R293.1
OT_IOB5: R249.2 R294.2
OT_IOB6: R251.2 R295.1
OT_IOB7: R296.2
OT_IOB8: R297.1
OT_IOB9: R298.2
OT_IOB10: R299.1
OT_IOB11: R245.1 R300.2
OT_IOB12: R246.1 R301.1
PMOD2_IO4_3V3: R248.1 R303.1
PMOD2_IO7_3V3: R250.1 R302.2
PMOD2_IO8_3V3: R252.1 R304.2
NetJ14_4: J14.4 R242.1
NetJ14_5: J14.5 R243.2
NetJ14_6: J14.6 R244.1
NetJ14_7: J14.7 R245.2
NetJ14_9: J14.9 R246.2
NetJ14_10: J14.10 R247.1
NetJ14_11: J14.11 R248.2
NetJ14_12: J14.12 R249.1
NetJ14_13: J14.13 R250.2
NetJ14_14: J14.14 R251.1
NetJ14_15: J14.15 R252.2
NetJ14_16: J14.16 R253.1
NetPMOD1_1: PMOD1.1(IO1) R289.2
NetPMOD1_2: PMOD1.2(IO2) R291.2
NetPMOD1_3: PMOD1.3(IO3) R293.2
NetPMOD1_4: PMOD1.4(IO4) R295.2
NetPMOD1_7: PMOD1.7(IO5) R290.1
NetPMOD1_8: PMOD1.8(IO6) R292.1
NetPMOD1_9: PMOD1.9(IO7) R294.1
NetPMOD1_10: PMOD1.10(IO8) R296.1
NetPMOD2_1: PMOD2.1(IO1) R297.2
NetPMOD2_2: PMOD2.2(IO2) R299.2
NetPMOD2_3: PMOD2.3(IO3) R301.2
NetPMOD2_4: PMOD2.4(IO4) R303.2
NetPMOD2_7: PMOD2.7(IO5) R298.1
NetPMOD2_8: PMOD2.8(IO6) R300.1
NetPMOD2_9: PMOD2.9(IO7) R302.1
NetPMOD2_10: PMOD2.10(IO8) R304.1

Not connected (* = marked no-connect by the designer): J14 1 3 18 20

### Notes on the sheet
- NOTES:
  * Watch VIOB setting, CW normally is 3.3V
  * CW_OT_POR is active-high (inverted when connected to other nRST signals)
- Title:
- Date:
- Rev:
- Time:
- Project:
- Sheet
- of
- License:
- Copyright © NewAE Technology Inc.
- Approved:
- NewAE.com
- File:
- (in symbol CW20PIN_TH) 5V; GND; 3.3V; HS1; RST; HS2; MISO; VREF; MOSI; IO1; TSCK; IO2; PDIC; IO3; PDID; IO4

### Library data of the parts
J14 = CW20PIN_TH: Component Group: Connector; Part Number: CW20PIN_TH; Pin Count: 20; Component Kind: Standard; Component Type: Standard
JP9 = Header 3X2: Header, 3-Pin, Dual row; LatestRevisionDate: 17-Jul-2002; LatestRevisionNote: Re-released for DXP Platform.; Publisher: Altium Limited
PMOD1 PMOD2 = PMOD_2ROW_FEMALERATH: Component Group: Connector; PP Material Stack: 0; Part Number: PMOD_2ROW_FEMALERATH; Pin Count: 12; Supplier 1: Digi-Key; Supplier Part Number 1: ?????; Component Kind: Standard; Component Type: Standard; PP Rotation: 0; PP Rotation1: 0
R242-R253 R289-R304 = RCHIP-10R-0402: 10R res, 0402, 1%, 1/16W; Manufacture 1: Yageo; Manufacture Part Number 1: RC0402FR-0710RL; Component Group: Resistor; Case-EIA: 0402; Case-Metric: 1005; Rated Power: 0.063W; Rated Voltage: 75VDC; Part Number: RCHIP-10R-0402; Footprint: 0402; Pin Count: 2; Supplier 1: Digi-Key; Supplier Part Number 1: 311-10.0LRCT-ND; Value: 10R; Tolerance: 1%; Mounting Technology: SMT; Temperature Range: -55C to 155C; Component Kind: Standard; Component Type: Standard
TP8 TP9 TP13 = KEYSTONE_5011: TEST POINT PC MULTI PURPOSE BLK; Part Number: KEYSTONE_5011; Component Group: Test Point; Pin Count: 1; Supplier 1: Digi-Key; Supplier Part Number 1: 36-5011-ND; Mounting Technology: Through-hole; Component Kind: Standard; Component Type: Standard
TP12 TP14 TP15 = KEYSTONE_5008: TEST POINT PC COMPACT .063"D ORG; Part Number: KEYSTONE_5008; Component Group: Test Point; Pin Count: 1; Supplier 1: Digi-Key; Supplier Part Number 1: 36-5008-ND; Mounting Technology: Through-hole; Component Kind: Standard; Component Type: Standard

## Sheet CW340_USERIO_USB.SchDoc: User USB Connection
size Letter; Organization: NewAE Technology Inc.; Address1: 1083 Queen St., Suite 196; Address2: Halifax; Address3: NS; Address4: Canada B3H 0B2; DocumentNumber: .; Revision: .; SheetNumber: 27; SheetTotal: 31; SheetApproved: Yes
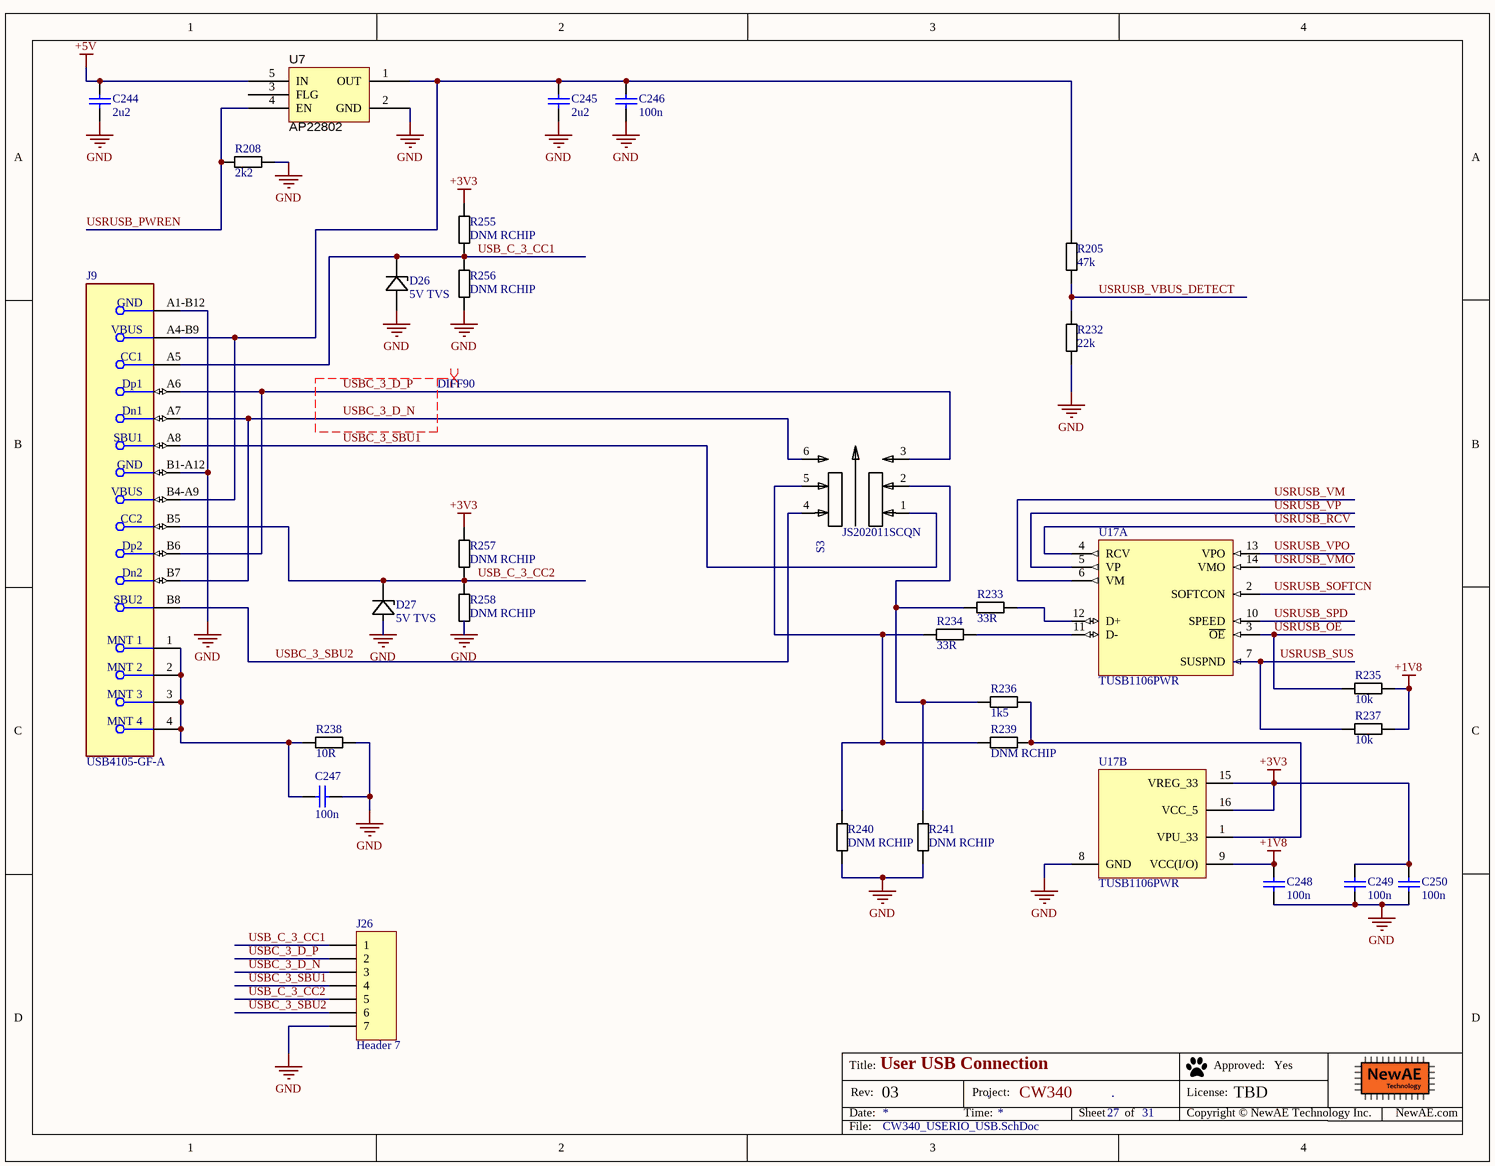
[diagram p18: CW340_USERIO_USB.SchDoc]

### Parts
C244  2u2  [CAPC0603_M]
C245  2u2  [CAPC0603_M]
C246  100n  [CAPC0402_M]
C247  100n  [CAPC0603_M]
C248  100n  [CAPC0402_M]
C249  100n  [CAPC0402_M]
C250  100n  [CAPC0402_M]
D26  5V TVS  [SOD-523]
D27  5V TVS  [SOD-523]
J9  USB4105-GF-A  [FP-USB4105-GF-A-MFG]
J26  Header 7  [HDR1X7]
R205  47k  [RESC1608X55N]
R208  2k2  [RESC1005X40N]
R232  22k  [RESC1608X55N]
R233  33R  [RESC1608X55N]
R234  33R  [RESC1608X55N]
R235  10k  [RESC1005X40N]
R236  1k5  [RESC1608X55N]
R237  10k  [RESC1005X40N]
R238  10R  [RESC1608X55N]
R239  DNM RCHIP  [RESC1608X55N]
R240  DNM RCHIP  [RESC1608X55N]
R241  DNM RCHIP  [RESC1608X55N]
R255  DNM RCHIP  [RESC1608X55N]
R256  DNM RCHIP  [RESC1608X55N]
R257  DNM RCHIP  [RESC1608X55N]
R258  DNM RCHIP  [RESC1608X55N]
S3  JS202011SCQN  [SW_JS202011SCQN]
U7  AP22802  [SOT23-5P95_285X145L45X40]
U17  TUSB1106PWR  [PW0016A_L]  (parts A,B of 2)

### Nets
+1V8: C248.1 R235.2 R237.2 U17.9(VCC(I/O))
+3V3: C249.1 C250.1 R255.1 R257.1 U17.15(VREG_33) U17.16(VCC_5)
+5V: C244.1 U7.5(IN)
GND: C244.2 C245.2 C246.2 C247.2 C248.2 C249.2 C250.2 D26.2(A) D27.2(A) J9.A1-B12(GND) J9.B1-A12(GND) J26.7 R208.2 R232.2 R238.2 R240.1 R241.1 R256.2 R258.2 U7.2(GND) U17.8(GND)
USB_C_3_CC1: D26.1(K) J9.A5(CC1) J26.1 R255.2 R256.1
USB_C_3_CC2: D27.1(K) J9.B5(CC2) J26.5 R257.2 R258.1
USBC_3_D_N: J9.A7(Dn1) J9.B7(Dn2) J26.3 S3.6
USBC_3_D_P: J9.A6(Dp1) J9.B6(Dp2) J26.2 S3.3
USBC_3_SBU1: J9.A8(SBU1) J26.4 S3.1
USBC_3_SBU2: J9.B8(SBU2) J26.6 S3.4
USRUSB_OE: R235.1 U17.3(~{OE})
USRUSB_PWREN: R208.1 U7.4(EN)
USRUSB_RCV: U17.4(RCV)
USRUSB_SOFTCN: U17.2(SOFTCON)
USRUSB_SPD: U17.10(SPEED)
USRUSB_SUS: R237.1 U17.7(SUSPND)
USRUSB_VBUS_DETECT: R205.2 R232.1
USRUSB_VM: U17.6(VM)
USRUSB_VMO: U17.14(VMO)
USRUSB_VP: U17.5(VP)
USRUSB_VPO: U17.13(VPO)
NetC245_1: C245.1 C246.1 J9.A4-B9(VBUS) J9.B4-A9(VBUS) R205.1 U7.1(OUT)
NetC247_1: C247.1 J9.1(MNT_1) J9.2(MNT_2) J9.3(MNT_3) J9.4(MNT_4) R238.1
NetR233_1: R233.1 R236.1 R241.2 S3.2
NetR233_2: R233.2 U17.12(D+)
NetR234_1: R234.1 R239.1 R240.2 S3.5
NetR234_2: R234.2 U17.11(D-)
NetR236_2: R236.2 R239.2 U17.1(VPU_33)

Not connected (* = marked no-connect by the designer): U7 3(FLG)

### Layout directives
differential pair; differential pair class DIFF90: USBC_3_D_N, USBC_3_D_P

### Notes on the sheet
- Title:
- Date:
- Rev:
- Time:
- Project:
- Sheet
- of
- License:
- Copyright © NewAE Technology Inc.
- Approved:
- NewAE.com
- File:

### Library data of the parts
C244 C245 = CCHIP-2u2-0603: 2u2, 0603; Manufacture 1: Samsung; Manufacture Part Number 1: CL10B225KP8NNNC; Component Group: Capacitor; Case-EIA: 0603; Case-Metric: 1608; Rated Voltage: 10VDC; Part Number: CCHIP-2u2-0603; Footprint: 0603; Pin Count: 2; Supplier 1: Digi-Key; Supplier Part Number 1: 1276-1134-1-ND; Value: 2u2; Mounting Technology: SMT; Component Kind: Standard; Component Type: Standard
C246 C248-C250 = CCHIP-100n-0402: as C37 on sheet CW340_SAM3X_MISC; Part Number: CCHIP-100n-0402; Footprint: 0402; Pin Count: 2; Value: 100n; Mounting Technology: SMT; Component Kind: Standard; Component Type: Standard; Supplier 1: Digi-Key; Supplier Part Number 1: 445-6901-1-ND
C247 = CCHIP-100n-0603: as C7 on sheet CW340_USERIO_debug; Part Number: CCHIP-100n-0603; Footprint: 0603; Pin Count: 2; Supplier 1: Digi-Key; Supplier Part Number 1: 399-5089-2-ND; Value: 100n; Mounting Technology: SMT; Component Kind: Standard; Component Type: Standard
D26 D27 = VESD05B1-02V-G3-08: TVS DIODE 1VSO 5VBD SOD523; Manufacture 1: Vishay; PP Material Stack: 0; Part Number: VESD05B1-02V-G3-08; Component Group: Diode; Manufacture Part Number 1: VESD05B1-02V-G3-08; Pin Count: 2; Supplier 1: Digi-Key; Supplier Part Number 1: VESD05B1-02V-G3-08GICT-ND; Mounting Technology: SMT; RoHS: Yes; Component Kind: Standard; Component Type: Standard; PP Rotation: 0
J9 = CMP-245163-000001-1: CONN RCPT USB2.0 TYPEC 5A; Manufacturer: GCT; Voltage Rating: 20V; Is Female: yes; Current Rating: 5/6.25/1.25/0.25A; Number Of Contacts: 16; Conn Orientation: Right Angle; Device Class L1: Connectors; Category: Conn; Lead Free: Yes; RoHS: TRUE; Temperature Range High: +85°C; Digikey Description: CONN RCPT USB2.0 TYPEC 5A; Device Class L3: unset; ComponentLink2Description: Datasheet; Manufacturer Part Number: USB4105-GF-A; Package: 0; Usb Standard: USB 2.0; Device Class L2: USB Connectors; Automotive: No; Temperature Range Low: -40°C; Height: 3.46mm; Temperature: -40°C to +85°C; Contact Material: Gold,Nickel; ComponentLink2URL: https://gct.co/files/drawings/usb4105.pdf; Octopart: https://octopart.com/usb4105-gf-a-gct-106627878
J26 = Header 7: Header, 7-Pin; LatestRevisionDate: 17-Jul-2002; LatestRevisionNote: Re-released for DXP Platform.; Publisher: Altium Limited
R205 = RCHIP-47K-0603: as R133 on sheet CW340_SAM3X_USB; Part Number: RCHIP-47K-0603; Footprint: 0603; Pin Count: 2; Supplier 1: Digi-Key; Supplier Part Number 1: 311-47.0KHRCT-ND; Value: 47k; Tolerance: 1%; Mounting Technology: SMT; Temperature Range: -55C to 155C; Component Kind: Standard; Component Type: Standard
R208 = RCHIP-2K2-0402: 2k2 res, 0402, 1%, 1/16W; Manufacture 1: Yageo; Manufacture Part Number 1: RC0402FR-072K2L; Component Group: Resistor; Case-EIA: 0402; Case-Metric: 1005; Rated Power: 0.063W; Rated Voltage: 75VDC; Part Number: RCHIP-2K2-0402; Footprint: 0402; Pin Count: 2; Supplier 1: Digi-Key; Supplier Part Number 1: 311-2.20KLRCT-ND; Value: 2k2; Tolerance: 1%; Mounting Technology: SMT; Temperature Range: -55C to 155C; Component Kind: Standard; Component Type: Standard
R232 = RCHIP-22K-0603: 22k res, 0603, 1%, 1/10W; Manufacture 1: Yageo; Manufacture Part Number 1: RC0603FR-0722KL; Component Group: Resistor; Case-EIA: 0603; Case-Metric: 1608; Rated Power: 0.1W; Rated Voltage: 75VDC; Part Number: RCHIP-22K-0603; Footprint: 0603; Pin Count: 2; Supplier 1: Digi-Key; Supplier Part Number 1: 311-22.0KHRCT-ND; Value: 22k; Tolerance: 1%; Mounting Technology: SMT; Temperature Range: -55C to 155C; Component Kind: Standard; Component Type: Standard
R233 R234 = RCHIP-33R-0603: 33R res, 0603, 1%, 1/10W; Manufacture 1: Yageo; Manufacture Part Number 1: RC0603FR-0733RL; Component Group: Resistor; Case-EIA: 0603; Case-Metric: 1608; Rated Power: 0.1W; Rated Voltage: 75VDC; Part Number: RCHIP-33R-0603; Footprint: 0603; Pin Count: 2; Supplier 1: Digi-Key; Supplier Part Number 1: 311-33.0HRCT-ND; Value: 33R; Tolerance: 1%; Mounting Technology: SMT; Temperature Range: -55C to 155C; Component Kind: Standard; Component Type: Standard
R235 R237 = RCHIP-10K-0402: as R213-R220 on sheet CW340_STATUS_LEDs; Part Number: RCHIP-10K-0402; Footprint: 0402; Pin Count: 2; Supplier 1: Digi-Key; Supplier Part Number 1: 311-10.0KLRCT-ND; Value: 10k; Tolerance: 1%; Mounting Technology: SMT; Temperature Range: -55C to 155C; Component Kind: Standard; Component Type: Standard
R236 = RCHIP-1K5-0603: 1k5 res, 0603, 1%, 1/10W; Manufacture 1: Yageo; Manufacture Part Number 1: RC0603FR-071K5L; Component Group: Resistor; Case-EIA: 0603; Case-Metric: 1608; Rated Power: 0.1W; Rated Voltage: 75VDC; Part Number: RCHIP-1K5-0603; Footprint: 0603; Pin Count: 2; Supplier 1: Digi-Key; Supplier Part Number 1: 311-1.50KHRCT-ND; Value: 1k5; Tolerance: 1%; Mounting Technology: SMT; Temperature Range: -55C to 155C; Component Kind: Standard; Component Type: Standard
R238 = RCHIP-10R-0603: as R135 on sheet CW340_SAM3X_USB; Part Number: RCHIP-10R-0603; Footprint: 0603; Pin Count: 2; Supplier 1: Digi-Key; Supplier Part Number 1: 311-10.0HRCT-ND; Value: 10R; Tolerance: 1%; Mounting Technology: SMT; Temperature Range: -55C to 155C; Component Kind: Standard; Component Type: Standard
R239-R241 R255-R258 = RCHIP-DNM-0603: as R15 on sheet CW340_SAM3X_MISC; Part Number: RCHIP-DNM-0603; Component Group: Resistor; Footprint: 0603; Pin Count: 2; Mounting Technology: SMT; Component Kind: Standard; Component Type: Standard
S3 = JS202011SCQN: DPDT SMD Switch, 300mA; Manufacture 1: C&K Components; Part Number: JS202011SCQN; Component Group: Switch; Manufacture Part Number 1: JS202011SCQN; Pin Count: 6; Supplier 1: Digi-Key; Supplier Part Number 1: 401-2002-1-ND; Value: DPDT; Mounting Technology: SMT; Component Kind: Standard; Component Type: Standard
U7 = AP22802: USB Power Switch, Digital IC; Manufacture 1: Diodes Inc; Company_PN: <Enter Company P/N>; Component Group: Analog IC; PP Material Stack: 0; Created By: D.GODDARD; Part Number: AP22802; Footprint: SOT25; Manufacture Part Number 1: AP22802; Pin Count: 5; Supplier 1: Digi-Key; Supplier Part Number 1: AP22802AW5-7DICT-ND; Component Kind: Standard; Component Type: Standard; PP Rotation: 0
U17 = CMP-0309-00090-2: Advanced USB Transciever, Full Speed, Differential, +/-15 KV, -40 to 85 degC, 16-Pin TSSOP (PW), Green (RoHS & no Sb/Br); Manufacturer: Texas Instruments; SubFamily: USB Transceiver; Eco-Plan: Green (RoHS & no Sb/Br); Mounting Technology: Surface Mount; USB Speed: Full; ComponentLink2URL: http://www.ti.com/lit/ml/mpds361/mpds361.pdf; PackageDescription: 16-Pin Plastic Thin Small Outline Package 5 x 4.4 mm Body ,0.65 mm Pitch; ComponentLink1URL: http://www.ti.com/general/docs/lit/getliterature.tsp?genericPartNumber=TUSB1106&fileType=pdf; DatasheetVersion: SCAS818E; PartNumber: TUSB1106PWR; PackageVersion: revG, Feb-2011; PackageReference: PW0016A; ComponentLink2Description: Package Specification; ESD HBM(kV): +/-15; Code_JEDEC: MO-153; ComponentLink1Description: Datasheet

## Sheet CW340_USERIO_SerialSelections.SchDoc: Serial Selection Jumpers
size Letter; Organization: NewAE Technology Inc.; Address1: 1083 Queen St., Suite 196; Address2: Halifax; Address3: NS; Address4: Canada B3H 0B2; SheetApproved: NO
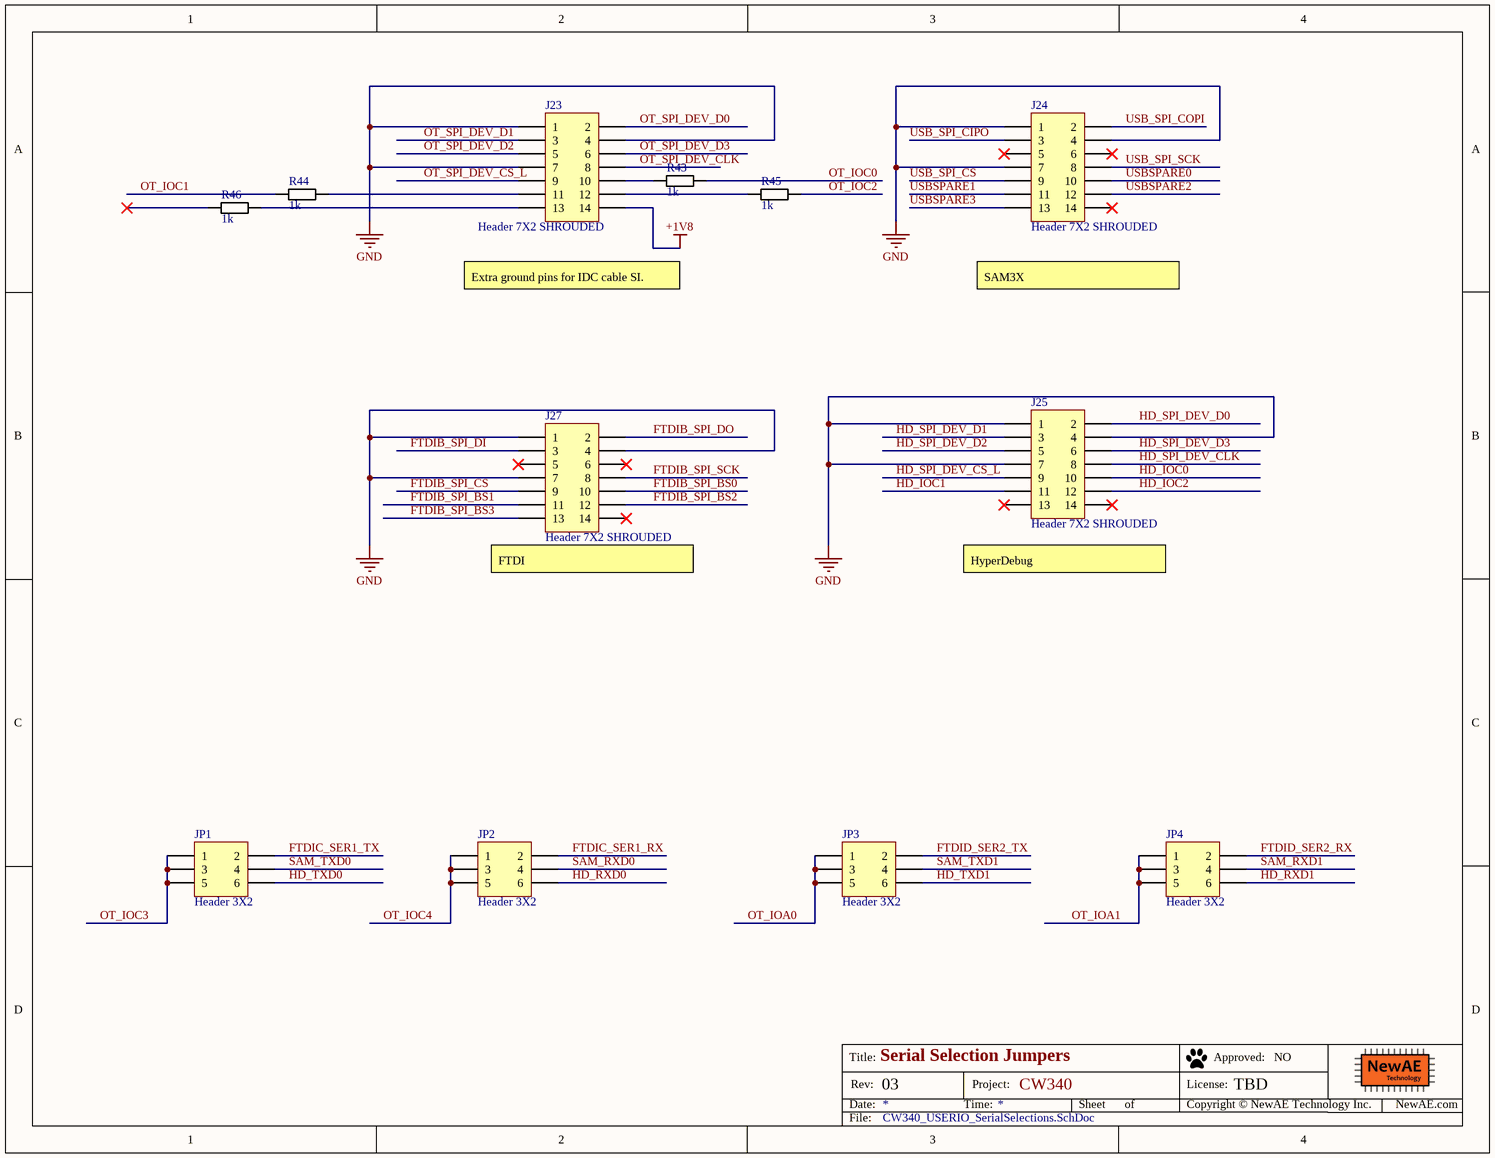
[diagram p19: CW340_USERIO_SerialSelections.SchDoc]

### Parts
J23  Header 7X2 SHROUDED  [HDR2X7]
J24  Header 7X2 SHROUDED  [HDR2X7]
J25  Header 7X2 SHROUDED  [HDR2X7]
J27  Header 7X2 SHROUDED  [HDR2X7]
JP1  Header 3X2  [HDR2X3]
JP2  Header 3X2  [HDR2X3]
JP3  Header 3X2  [HDR2X3]
JP4  Header 3X2  [HDR2X3]
R43  1k  [RESC1608X55N]
R44  1k  [RESC1608X55N]
R45  1k  [RESC1608X55N]
R46  1k  [RESC1608X55N]

### Nets
+1V8: J23.14
GND: J23.1 J23.4 J23.7 J24.1 J24.4 J24.7 J25.1 J25.4 J25.7 J27.1 J27.4 J27.7
FTDIB_SPI_BS0: J27.10
FTDIB_SPI_BS1: J27.11
FTDIB_SPI_BS2: J27.12
FTDIB_SPI_BS3: J27.13
FTDIB_SPI_CS: J27.9
FTDIB_SPI_DI: J27.3
FTDIB_SPI_DO: J27.2
FTDIB_SPI_SCK: J27.8
FTDIC_SER1_RX: JP2.2
FTDIC_SER1_TX: JP1.2
FTDID_SER2_RX: JP4.2
FTDID_SER2_TX: JP3.2
HD_IOC0: J25.10
HD_IOC1: J25.11
HD_IOC2: J25.12
HD_RXD0: JP2.6
HD_RXD1: JP4.6
HD_SPI_DEV_CLK: J25.8
HD_SPI_DEV_CS_L: J25.9
HD_SPI_DEV_D0: J25.2
HD_SPI_DEV_D1: J25.3
HD_SPI_DEV_D2: J25.5
HD_SPI_DEV_D3: J25.6
HD_TXD0: JP1.6
HD_TXD1: JP3.6
OT_IOA0: JP3.1 JP3.3 JP3.5
OT_IOA1: JP4.1 JP4.3 JP4.5
OT_IOC0: R43.2
OT_IOC1: R44.1
OT_IOC2: R45.2
OT_IOC3: JP1.1 JP1.3 JP1.5
OT_IOC4: JP2.1 JP2.3 JP2.5
OT_SPI_DEV_CLK: J23.8
OT_SPI_DEV_CS_L: J23.9
OT_SPI_DEV_D0: J23.2
OT_SPI_DEV_D1: J23.3
OT_SPI_DEV_D2: J23.5
OT_SPI_DEV_D3: J23.6
SAM_RXD0: JP2.4
SAM_RXD1: JP4.4
SAM_TXD0: JP1.4
SAM_TXD1: JP3.4
USB_SPI_CIPO: J24.3
USB_SPI_COPI: J24.2
USB_SPI_CS: J24.9
USB_SPI_SCK: J24.8
USBSPARE0: J24.10
USBSPARE1: J24.11
USBSPARE2: J24.12
USBSPARE3: J24.13
NetJ23_10: J23.10 R43.1
NetJ23_11: J23.11 R44.2
NetJ23_12: J23.12 R45.1
NetJ23_13: J23.13 R46.2

Not connected (* = marked no-connect by the designer): J24 5* 6* 14*; J25 13* 14*; J27 5* 6* 14*; R46 1*

### Notes on the sheet
- Extra ground pins for IDC cable SI.
- SAM3X
- (near J27) FTDI
- (near J25) HyperDebug
- Title:
- Date:
- Rev:
- Time:
- Project:
- Sheet
- of
- License:
- Copyright © NewAE Technology Inc.
- Approved:
- NewAE.com
- File:

### Library data of the parts
J23-J25 J27 = Header 7X2: Header, 7-Pin, Dual row; LatestRevisionDate: 17-Jul-2002; LatestRevisionNote: Re-released for DXP Platform.; Publisher: Altium Limited
JP1-JP4 = Header 3X2: Header, 3-Pin, Dual row; LatestRevisionDate: 17-Jul-2002; LatestRevisionNote: Re-released for DXP Platform.; Publisher: Altium Limited
R43-R46 = RCHIP-1K-0603: as R41 on sheet CW340_USERIO_debug; Part Number: RCHIP-1K-0603; Footprint: 0603; Pin Count: 2; Supplier 1: Digi-Key; Supplier Part Number 1: 311-1.00KHRCT-ND; Value: 1k; Tolerance: 1%; Mounting Technology: SMT; Temperature Range: -55C to 155C; Component Kind: Standard; Component Type: Standard

## Sheet CW340_USERIO_Breakout.SchDoc: Breakout from Edge Connector
size Letter; Organization: NewAE Technology Inc.; Address1: 1083 Queen St., Suite 196; Address2: Halifax; Address3: NS; Address4: Canada B3H 0B2; SheetApproved: NO
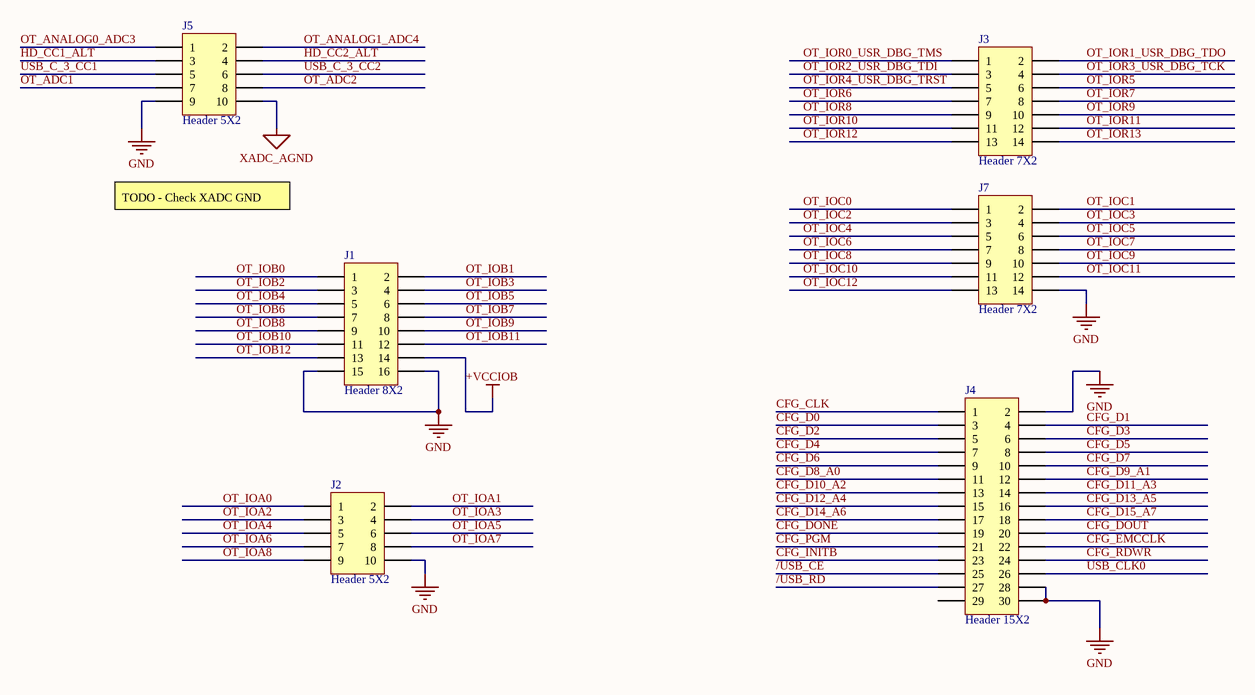
[diagram p20: CW340_USERIO_Breakout.SchDoc]

### Parts
J1  Header 8X2  [HDR2X8]
J2  Header 5X2  [HDR2X5]
J3  Header 7X2  [HDR2X7]
J4  Header 15X2  [HDR2X15]
J5  Header 5X2  [HDR2X5]
J7  Header 7X2  [HDR2X7]

### Nets
+VCCIOB: J1.14
GND: J1.15 J1.16 J2.10 J4.2 J4.28 J4.30 J5.9 J7.14
XADC_AGND: J5.10
/USB_CE: J4.25
/USB_RD: J4.27
CFG_CLK: J4.1
CFG_D0: J4.3
CFG_D1: J4.4
CFG_D2: J4.5
CFG_D3: J4.6
CFG_D4: J4.7
CFG_D5: J4.8
CFG_D6: J4.9
CFG_D7: J4.10
CFG_D8_A0: J4.11
CFG_D9_A1: J4.12
CFG_D10_A2: J4.13
CFG_D11_A3: J4.14
CFG_D12_A4: J4.15
CFG_D13_A5: J4.16
CFG_D14_A6: J4.17
CFG_D15_A7: J4.18
CFG_DONE: J4.19
CFG_DOUT: J4.20
CFG_EMCCLK: J4.22
CFG_INITB: J4.23
CFG_PGM: J4.21
CFG_RDWR: J4.24
HD_CC1_ALT: J5.3
HD_CC2_ALT: J5.4
OT_ADC1: J5.7
OT_ADC2: J5.8
OT_ANALOG0_ADC3: J5.1
OT_ANALOG1_ADC4: J5.2
OT_IOA0: J2.1
OT_IOA1: J2.2
OT_IOA2: J2.3
OT_IOA3: J2.4
OT_IOA4: J2.5
OT_IOA5: J2.6
OT_IOA6: J2.7
OT_IOA7: J2.8
OT_IOA8: J2.9
OT_IOB0: J1.1
OT_IOB1: J1.2
OT_IOB2: J1.3
OT_IOB3: J1.4
OT_IOB4: J1.5
OT_IOB5: J1.6
OT_IOB6: J1.7
OT_IOB7: J1.8
OT_IOB8: J1.9
OT_IOB9: J1.10
OT_IOB10: J1.11
OT_IOB11: J1.12
OT_IOB12: J1.13
OT_IOC0: J7.1
OT_IOC1: J7.2
OT_IOC2: J7.3
OT_IOC3: J7.4
OT_IOC4: J7.5
OT_IOC5: J7.6
OT_IOC6: J7.7
OT_IOC7: J7.8
OT_IOC8: J7.9
OT_IOC9: J7.10
OT_IOC10: J7.11
OT_IOC11: J7.12
OT_IOC12: J7.13
OT_IOR0_USR_DBG_TMS: J3.1
OT_IOR1_USR_DBG_TDO: J3.2
OT_IOR2_USR_DBG_TDI: J3.3
OT_IOR3_USR_DBG_TCK: J3.4
OT_IOR4_USR_DBG_TRST: J3.5
OT_IOR5: J3.6
OT_IOR6: J3.7
OT_IOR7: J3.8
OT_IOR8: J3.9
OT_IOR9: J3.10
OT_IOR10: J3.11
OT_IOR11: J3.12
OT_IOR12: J3.13
OT_IOR13: J3.14
USB_C_3_CC1: J5.5
USB_C_3_CC2: J5.6
USB_CLK0: J4.26

Not connected (* = marked no-connect by the designer): J4 29

### Notes on the sheet
- TODO - Check XADC GND
- Title:
- Date:
- Rev:
- Time:
- Project:
- Sheet
- of
- License:
- Copyright © NewAE Technology Inc.
- Approved:
- NewAE.com
- File:

### Library data of the parts
J1 = Header 8X2: Header, 8-Pin, Dual row; LatestRevisionDate: 17-Jul-2002; LatestRevisionNote: Re-released for DXP Platform.; Publisher: Altium Limited
J2 J5 = Header 5X2: Header, 5-Pin, Dual row; LatestRevisionDate: 17-Jul-2002; LatestRevisionNote: Re-released for DXP Platform.; Publisher: Altium Limited
J3 J7 = Header 7X2: Header, 7-Pin, Dual row; LatestRevisionDate: 17-Jul-2002; LatestRevisionNote: Re-released for DXP Platform.; Publisher: Altium Limited
J4 = Header 15X2: Header, 15-Pin, Dual row; LatestRevisionDate: 17-Jul-2002; LatestRevisionNote: Re-released for DXP Platform.; Publisher: Altium Limited